# EAGLE design Pi Supply Smart LoRa Gateway (EAGLE 9.5.2)

## Sheet 1 of 5
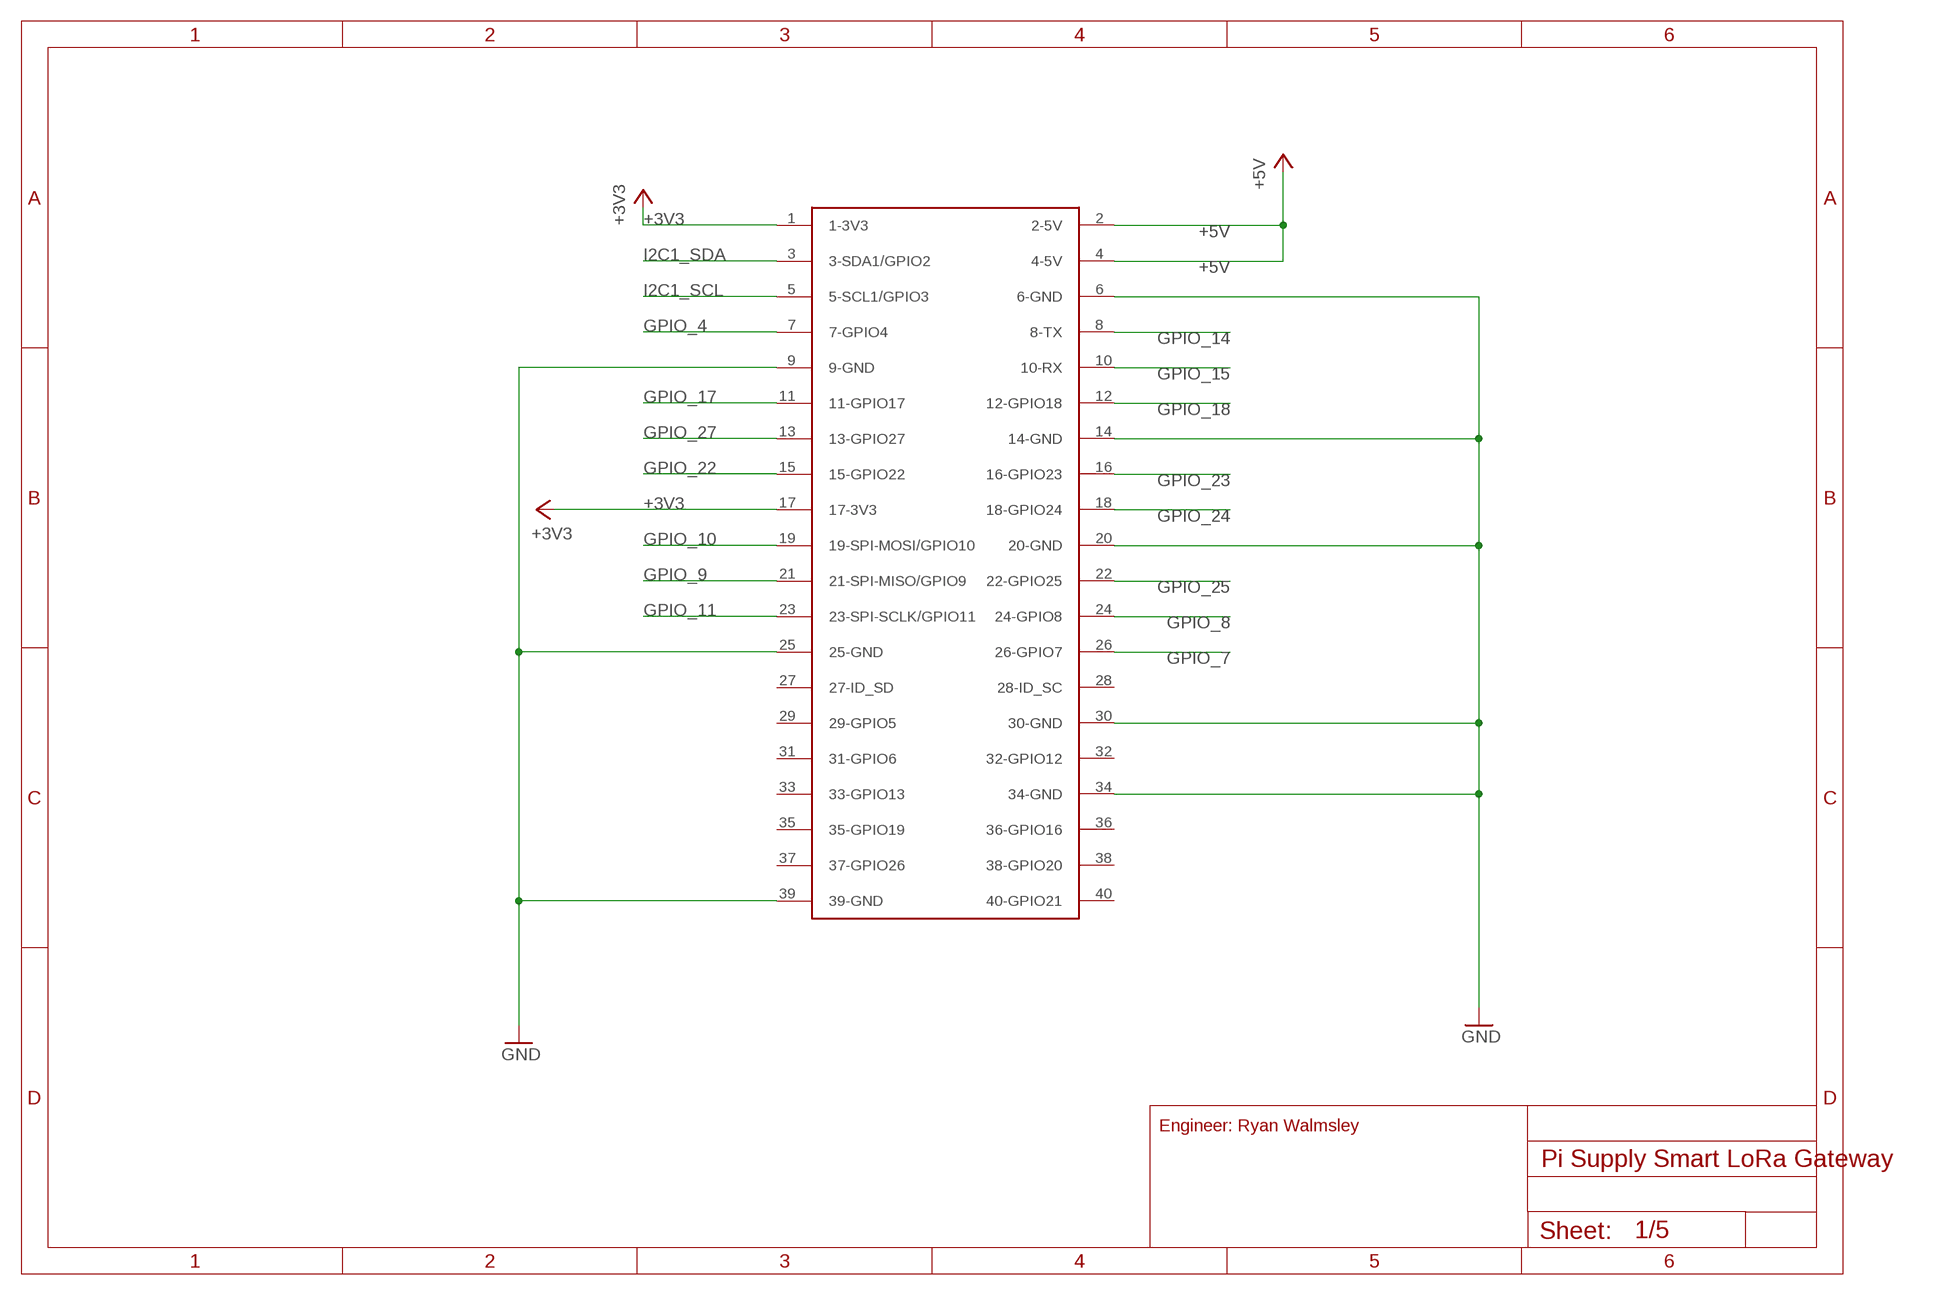
[diagram p0: schematic, sheet 1]

### Parts
U$5  RASPBERRY-PI+NONOTCHES  [RASPBERRY-PI-PLUS]

### Nets
+3V3: U$5.1(1-3V3) U$5.17(17-3V3) ; also sheet 3,4,5
+5V: U$5.2(2-5V) U$5.4(4-5V) ; also sheet 2,4,5
GND: U$5.6(6-GND) U$5.9(9-GND) U$5.14(14-GND) U$5.20(20-GND) U$5.25(25-GND) U$5.30(30-GND) U$5.34(34-GND) U$5.39(39-GND) ; also sheet 2,3,4,5
GPIO_4: U$5.7(7-GPIO4) ; also sheet 2
GPIO_7: U$5.26(26-GPIO7)
GPIO_8: U$5.24(24-GPIO8) ; also sheet 2
GPIO_9: U$5.21(21-SPI-MISO/GPIO9) ; also sheet 2
GPIO_10: U$5.19(19-SPI-MOSI/GPIO10) ; also sheet 2
GPIO_11: U$5.23(23-SPI-SCLK/GPIO11) ; also sheet 2
GPIO_14: U$5.8(8-TX) ; also sheet 2
GPIO_15: U$5.10(10-RX) ; also sheet 2
GPIO_17: U$5.11(11-GPIO17) ; also sheet 2
GPIO_18: U$5.12(12-GPIO18) ; also sheet 2
GPIO_22: U$5.15(15-GPIO22) ; also sheet 2
GPIO_23: U$5.16(16-GPIO23) ; also sheet 2
GPIO_24: U$5.18(18-GPIO24) ; also sheet 2
GPIO_25: U$5.22(22-GPIO25) ; also sheet 2
GPIO_27: U$5.13(13-GPIO27) ; also sheet 2
I2C1_SCL: U$5.5(5-SCL1/GPIO3) ; also sheet 2,3
I2C1_SDA: U$5.3(3-SDA1/GPIO2) ; also sheet 2,3
Unconnected: U$5.27(27-ID_SD) U$5.28(28-ID_SC) U$5.29(29-GPIO5) U$5.31(31-GPIO6) U$5.32(32-GPIO12) U$5.33(33-GPIO13) U$5.35(35-GPIO19) U$5.36(36-GPIO16) U$5.37(37-GPIO26) U$5.38(38-GPIO20) U$5.40(40-GPIO21)

### Notes on the sheet
- Engineer: Ryan Walmsley

## Sheet 2 of 5
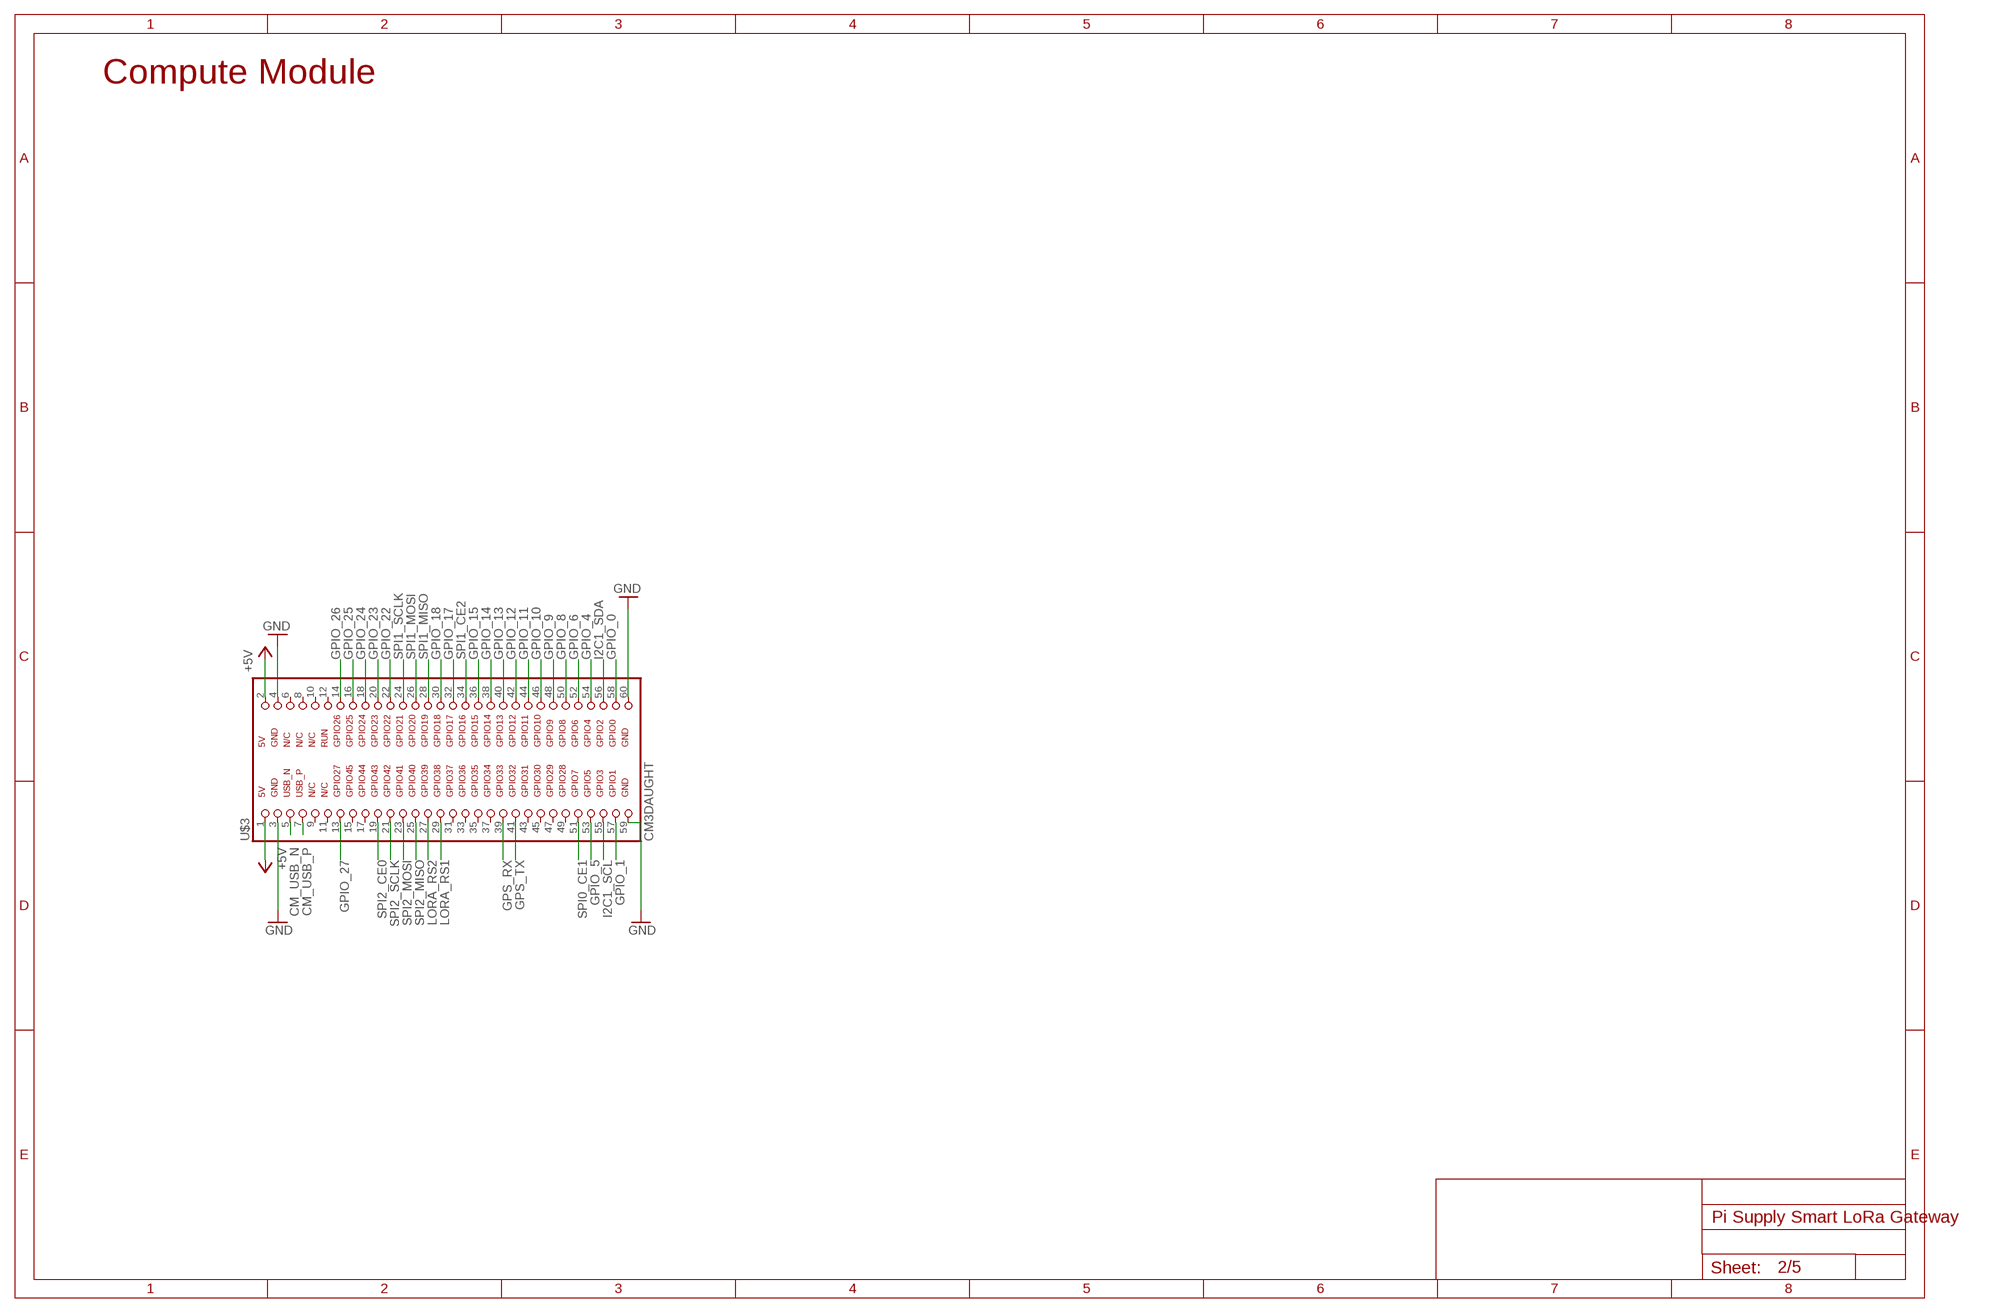
[diagram p1: schematic, sheet 2]

### Parts
U$3  CM3DAUGHT  [2X30]

### Nets
+5V: U$3.1(5V) U$3.2(5V) ; also sheet 1,4,5
CM_USB_N: U$3.5(USB_N) ; also sheet 5
CM_USB_P: U$3.7(USB_P) ; also sheet 5
GND: U$3.3(GND) U$3.4(GND) U$3.59(GND) U$3.60(GND) ; also sheet 1,3,4,5
GPIO_0: U$3.58(GPIO0)
GPIO_1: U$3.57(GPIO1)
GPIO_4: U$3.54(GPIO4) ; also sheet 1
GPIO_5: U$3.53(GPIO5)
GPIO_6: U$3.52(GPIO6)
GPIO_8: U$3.50(GPIO8) ; also sheet 1
GPIO_9: U$3.48(GPIO9) ; also sheet 1
GPIO_10: U$3.46(GPIO10) ; also sheet 1
GPIO_11: U$3.44(GPIO11) ; also sheet 1
GPIO_12: U$3.42(GPIO12)
GPIO_13: U$3.40(GPIO13)
GPIO_14: U$3.38(GPIO14) ; also sheet 1
GPIO_15: U$3.36(GPIO15) ; also sheet 1
GPIO_17: U$3.32(GPIO17) ; also sheet 1
GPIO_18: U$3.30(GPIO18) ; also sheet 1
GPIO_22: U$3.22(GPIO22) ; also sheet 1
GPIO_23: U$3.20(GPIO23) ; also sheet 1
GPIO_24: U$3.18(GPIO24) ; also sheet 1
GPIO_25: U$3.16(GPIO25) ; also sheet 1
GPIO_26: U$3.14(GPIO26)
GPIO_27: U$3.13(GPIO27) ; also sheet 1
GPS_RX: U$3.39(GPIO33) ; also sheet 3
GPS_TX: U$3.41(GPIO32) ; also sheet 3
I2C1_SCL: U$3.55(GPIO3) ; also sheet 1,3
I2C1_SDA: U$3.56(GPIO2) ; also sheet 1,3
LORA_RS1: U$3.29(GPIO38) ; also sheet 3
LORA_RS2: U$3.27(GPIO39) ; also sheet 3
SPI0_CE1: U$3.51(GPIO7)
SPI1_CE2: U$3.34(GPIO16) ; also sheet 3
SPI1_MISO: U$3.28(GPIO19) ; also sheet 3
SPI1_MOSI: U$3.26(GPIO20) ; also sheet 3
SPI1_SCLK: U$3.24(GPIO21) ; also sheet 3
SPI2_CE0: U$3.19(GPIO43) ; also sheet 3
SPI2_MISO: U$3.25(GPIO40) ; also sheet 3
SPI2_MOSI: U$3.23(GPIO41) ; also sheet 3
SPI2_SCLK: U$3.21(GPIO42) ; also sheet 3
Unconnected: U$3.6 U$3.8 U$3.9 U$3.10 U$3.11 U$3.12 U$3.15(GPIO45) U$3.17(GPIO44) U$3.31(GPIO37) U$3.33(GPIO36) U$3.35(GPIO35) U$3.37(GPIO34) U$3.43(GPIO31) U$3.45(GPIO30) U$3.47(GPIO29) U$3.49(GPIO28)

### Notes on the sheet
- Compute Module

## Sheet 3 of 5
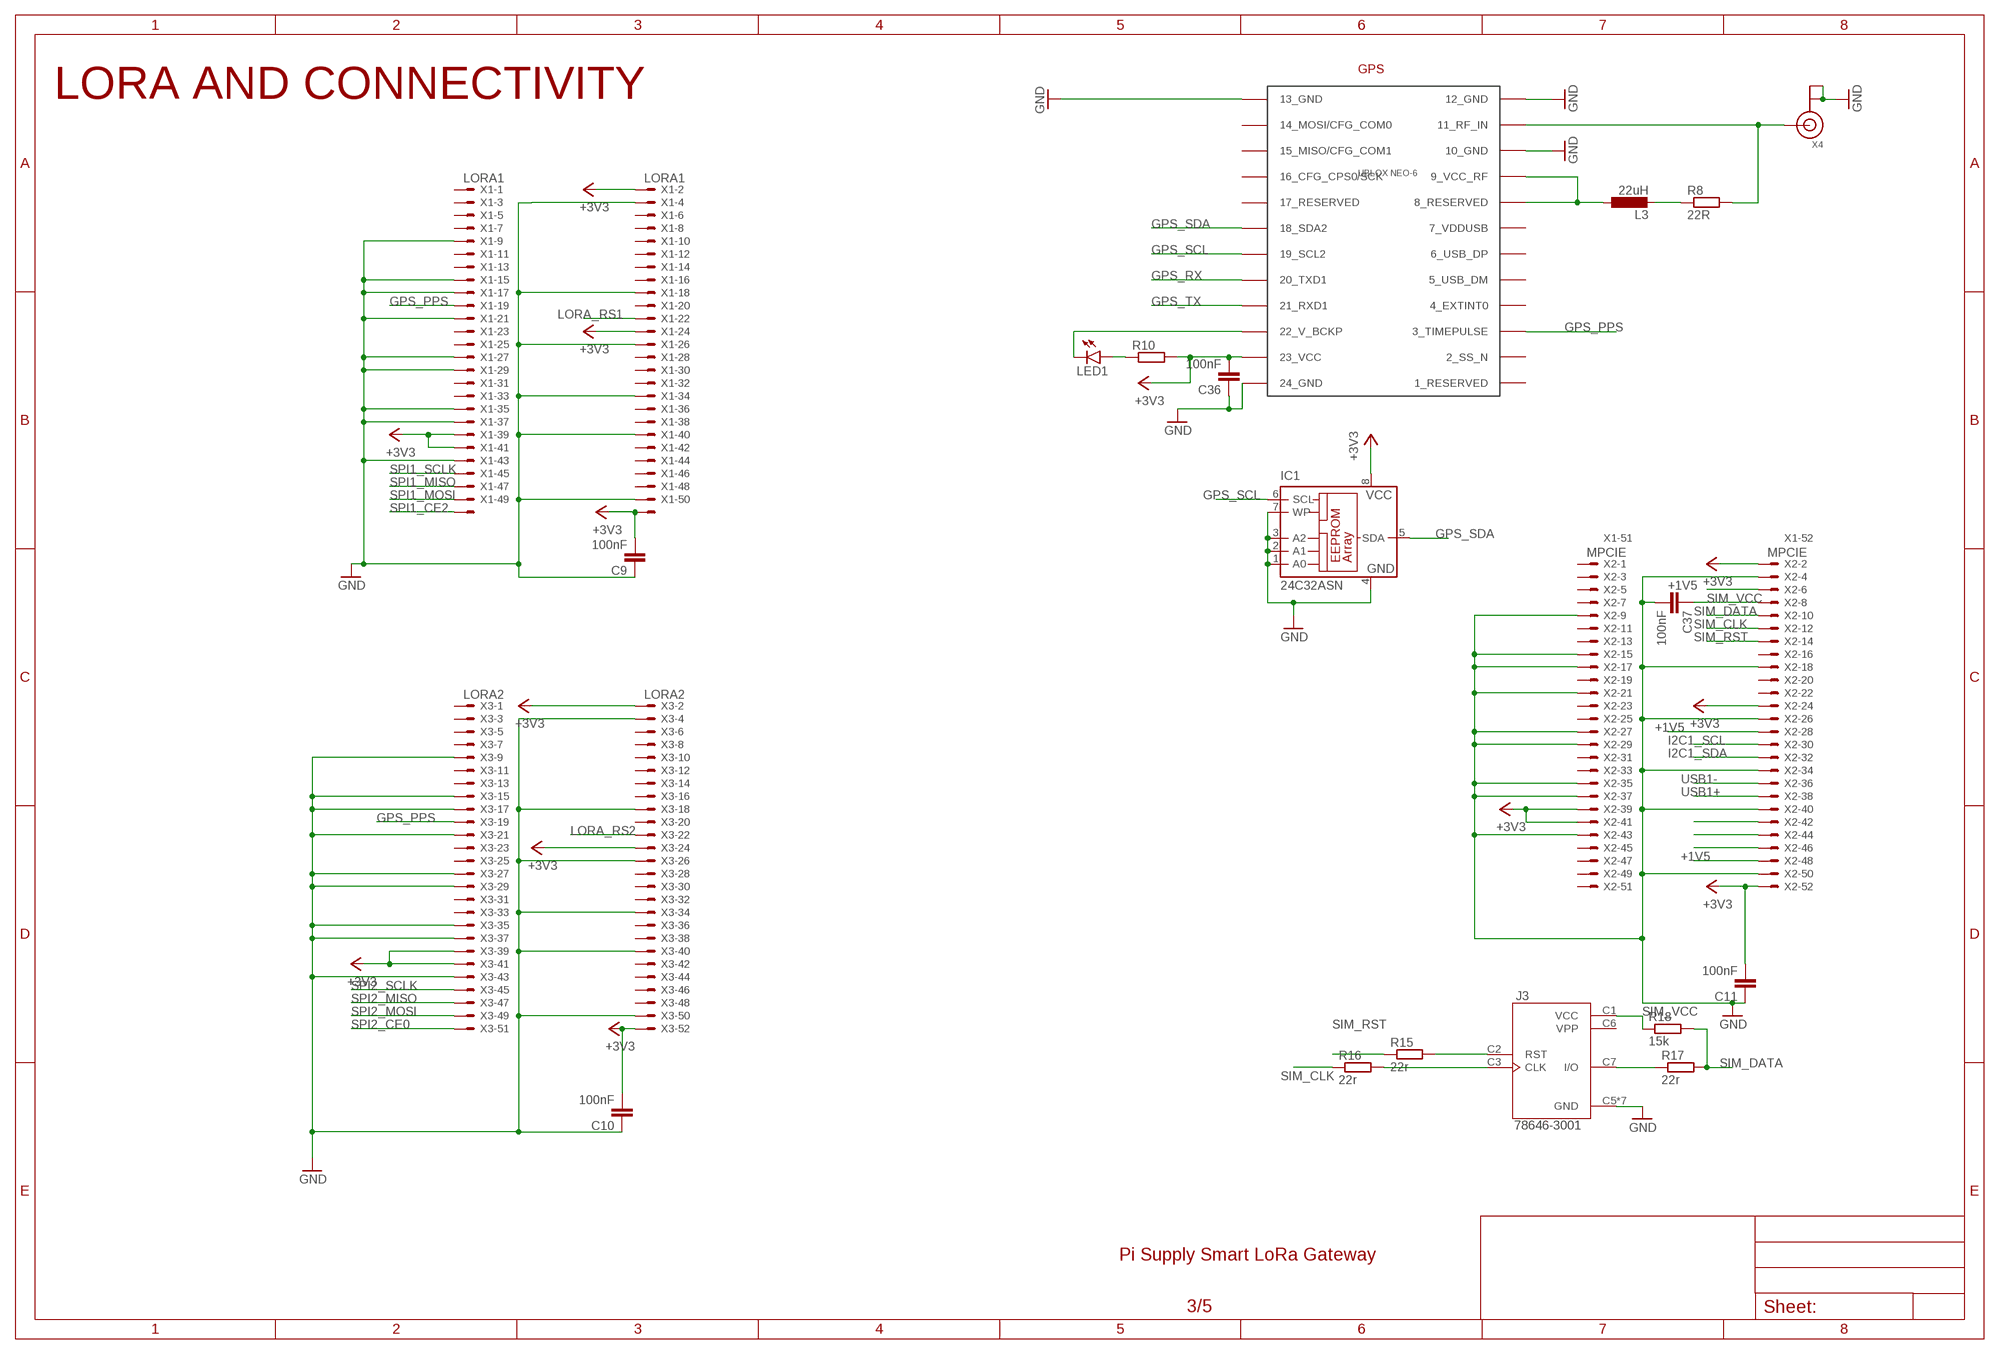
[diagram p2: schematic, sheet 3]

### Parts
C9  100nF  C-EUC0603  [C0603]
C10  100nF  C-EUC0603  [C0603]
C11  100nF  C-EUC0603  [C0603]
C36  100nF  C-EUC0603  [C0603]
C37  100nF  C-EUC0603  [C0603]
IC1  24C32ASN  [SO-08]
J3  78646-3001  [CONN_78646-3001]
L3  22uH  L-EUL2012C  [L2012C]
LED1  LEDCHIPLED_0603  [CHIPLED_0603]
R8  22R  R-EU_R0603  [R0603]
R10  R-EU_R0603  [R0603]
R15  22r  R-EU_R0603  [R0603]
R16  22r  R-EU_R0603  [R0603]
R17  22r  R-EU_R0603  [R0603]
R18  15k  R-EU_R0603  [R0603]
U$4  UBLOX_NEO-6  [UBLOX_NEO-6P]
X1  LORA1  679105700  [679105700]
X2  MPCIE  679105700  [679105700]
X3  LORA2  679105700  [679105700]
X4  ANTENNA_U.FL  [U.FL]

### Nets
+1V5: X2.6 X2.28 X2.48 ; also sheet 4
+3V3: C9.2 C10.2 C11.2 C36.2 IC1.8(VCC) R10.2 U$4.23_VCC X1.2 X1.24 X1.39 X1.41 X1.52 X2.2 X2.24 X2.39 X2.41 X2.52 X3.2 X3.24 X3.39 X3.41 X3.52 ; also sheet 1,4,5
GND: C9.1 C10.1 C11.1 C36.1 C37.2 IC1.1(A0) IC1.2(A1) IC1.3(A2) IC1.4(GND) IC1.7(WP) J3.C5(GND) J3.G1(GND) J3.G2(GND) J3.G3(GND) J3.G4(GND) J3.G5(GND) J3.G6(GND) U$4.10_GND U$4.12_GND U$4.13_GND U$4.24_GND X1.4 X1.9 X1.15 X1.17 X1.18 X1.21 X1.26 X1.27 X1.29 X1.34 X1.35 X1.37 X1.40 X1.43 X1.50 X2.4 X2.9 X2.15 X2.17 X2.18 X2.21 X2.26 X2.27 X2.29 X2.34 X2.35 X2.37 X2.40 X2.43 X2.50 X3.4 X3.9 X3.15 X3.17 X3.18 X3.21 X3.26 X3.27 X3.29 X3.34 X3.35 X3.37 X3.40 X3.43 X3.50 X4.1(GND) X4.2(GND) ; also sheet 1,2,4,5
GPS_PPS: U$4.3_TIMEPULSE X1.19 X3.19
GPS_RX: U$4.20_TXD1 ; also sheet 2
GPS_SCL: IC1.6(SCL) U$4.19_SCL2
GPS_SDA: IC1.5(SDA) U$4.18_SDA2
GPS_TX: U$4.21_RXD1 ; also sheet 2
I2C1_SCL: X2.30 ; also sheet 1,2
I2C1_SDA: X2.32 ; also sheet 1,2
LORA_RS1: X1.22 ; also sheet 2
LORA_RS2: X3.22 ; also sheet 2
N$5: L3.1 U$4.8_RESERVED U$4.9_VCC_RF
N$7: LED1.C U$4.22_V_BCKP
N$8: J3.C7(I/O) R17.1
N$10: J3.C2(RST) R15.2
N$13: J3.C3(CLK) R16.2
N$14: L3.2 R8.1
N$16: R8.2 U$4.11_RF_IN X4.3(SIGNAL)
N$17: LED1.A R10.1
N$29: X2.42
N$30: X2.44
N$31: X2.46
SIM_CLK: R16.1 X2.12
SIM_DATA: R17.2 R18.2 X2.10
SIM_RST: R15.1 X2.14
SIM_VCC: C37.1 J3.C1(VCC) R18.1 X2.8
SPI1_CE2: X1.51 ; also sheet 2
SPI1_MISO: X1.47 ; also sheet 2
SPI1_MOSI: X1.49 ; also sheet 2
SPI1_SCLK: X1.45 ; also sheet 2
SPI2_CE0: X3.51 ; also sheet 2
SPI2_MISO: X3.47 ; also sheet 2
SPI2_MOSI: X3.49 ; also sheet 2
SPI2_SCLK: X3.45 ; also sheet 2
USB1+: X2.38 ; also sheet 5
USB1-: X2.36 ; also sheet 5
Unconnected: U$4.1_RESERVED U$4.2_SS_N U$4.4_EXTINT0 U$4.5_USB_DM U$4.6_USB_DP U$4.7_VDDUSB U$4.14_MOSI/CFG_COM0 U$4.15_MISO/CFG_COM1 U$4.16_CFG_CPS0/SCK U$4.17_RESERVED X1.1 X1.3 X1.5 X1.6 X1.7 X1.8 X1.10 X1.11 X1.12 X1.13 X1.14 X1.16 X1.20 X1.23 X1.25 X1.28 X1.30 X1.31 X1.32 X1.33 X1.36 X1.38 X1.42 X1.44 X1.46 X1.48 X2.1 X2.3 X2.5 X2.7 X2.11 X2.13 X2.16 X2.19 X2.20 X2.22 X2.23 X2.25 X2.31 X2.33 X2.45 X2.47 X2.49 X2.51 X3.1 X3.3 X3.5 X3.6 X3.7 X3.8 X3.10 X3.11 X3.12 X3.13 X3.14 X3.16 X3.20 X3.23 X3.25 X3.28 X3.30 X3.31 X3.32 X3.33 X3.36 X3.38 X3.42 X3.44 X3.46 X3.48

### Notes on the sheet
- GPS
- LORA AND CONNECTIVITY

## Sheet 4 of 5
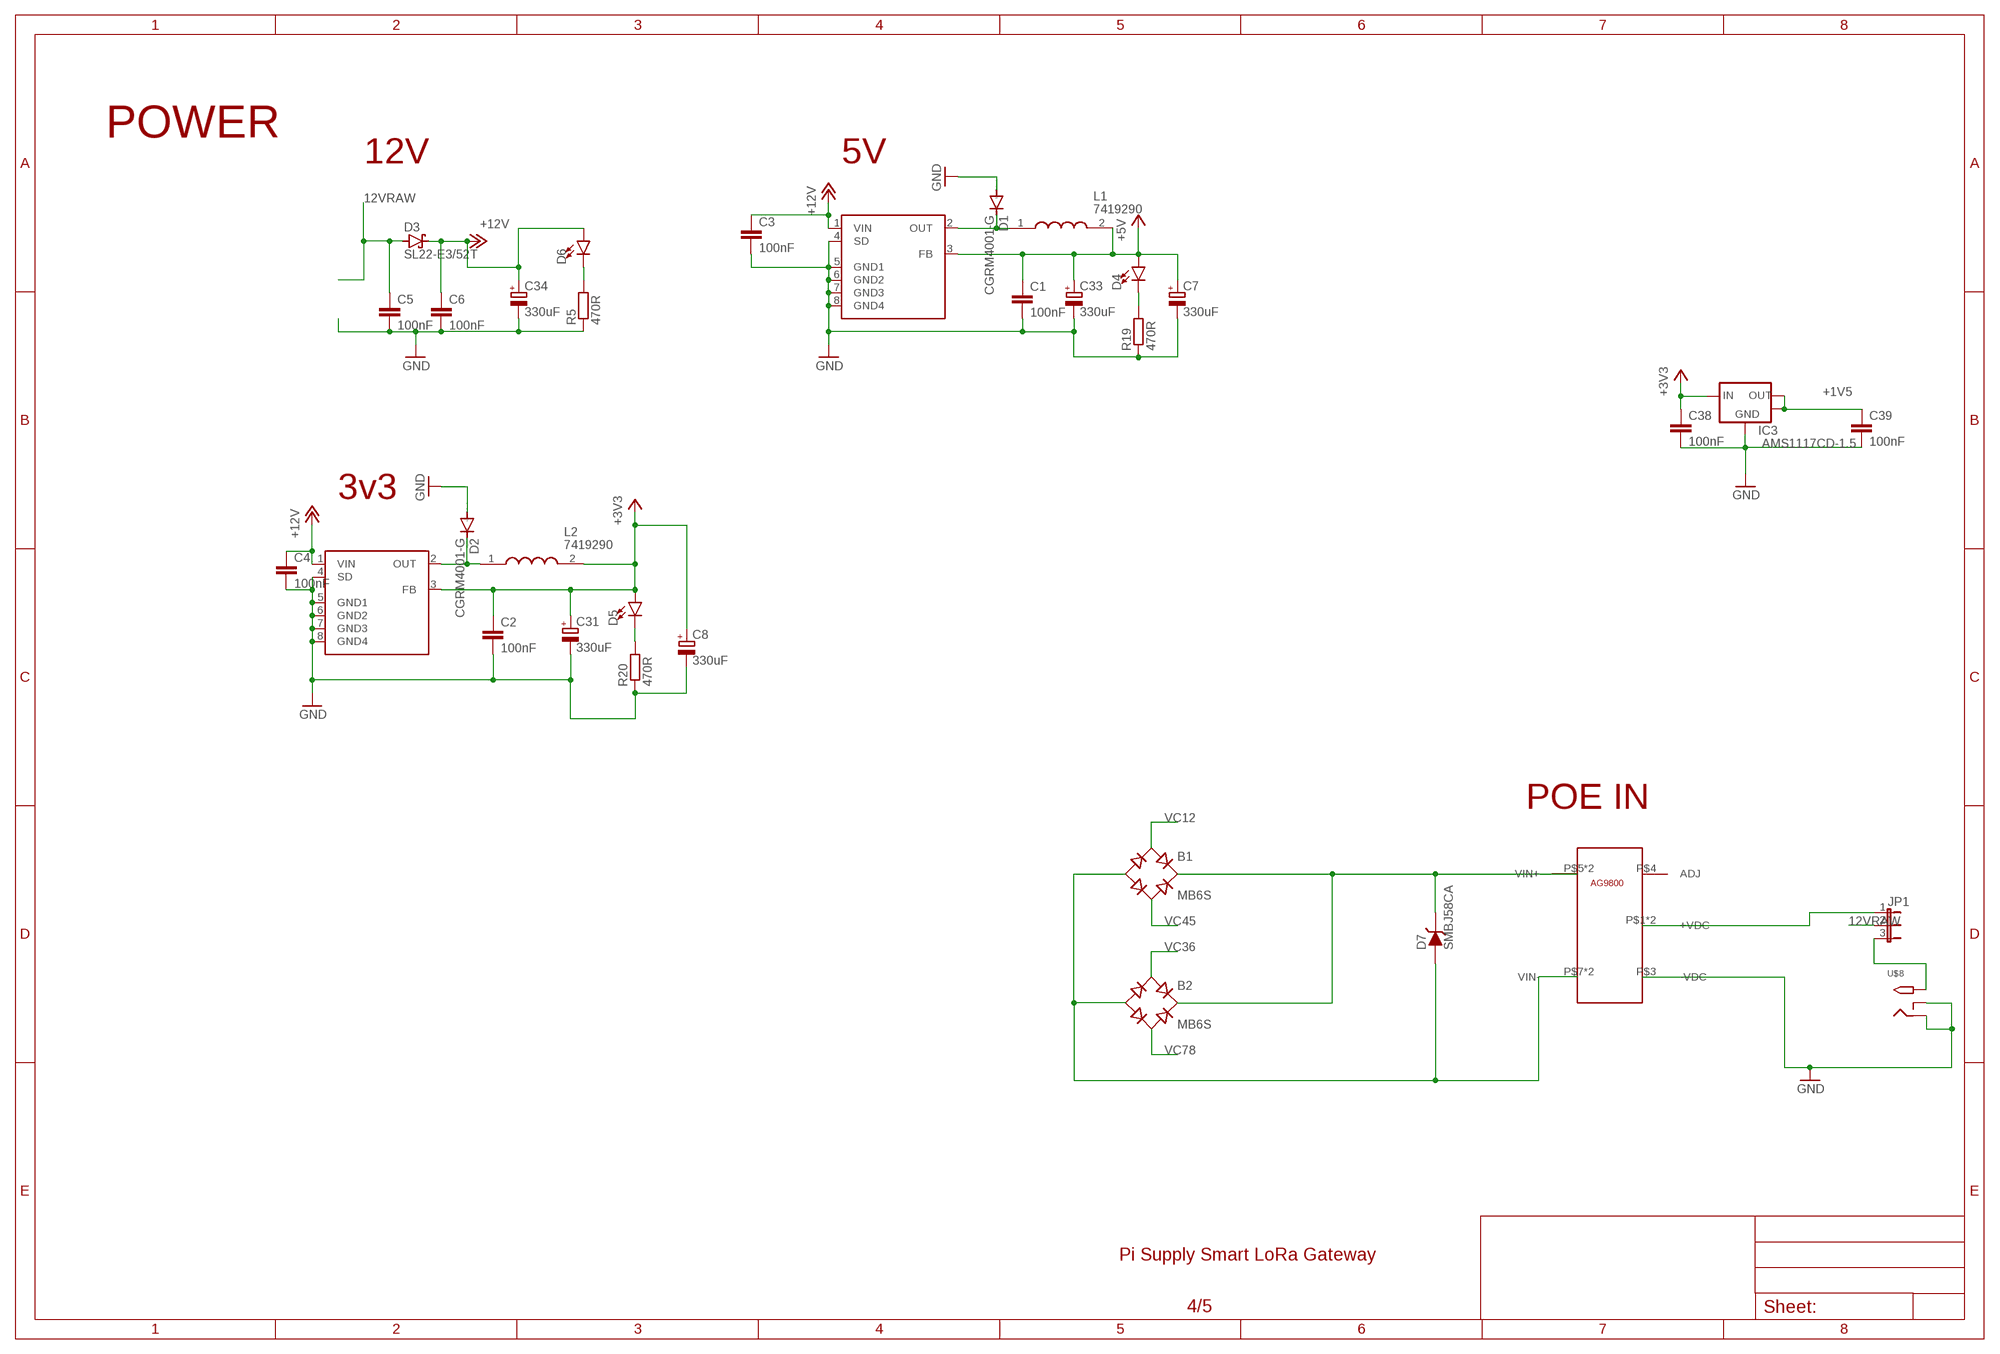
[diagram p3: schematic, sheet 4]

### Parts
B1  MB6S  [SOIC-4]
B2  MB6S  [SOIC-4]
C1  100nF  C-EUC0603  [C0603]
C2  100nF  C-EUC0603  [C0603]
C3  100nF  C-EUC0603  [C0603]
C4  100nF  C-EUC0603  [C0603]
C5  100nF  C-EUC0603  [C0603]
C6  100nF  C-EUC0603  [C0603]
C7  330uF  CPOL-EUE  [PANASONIC_E]
C8  330uF  CPOL-EUE  [PANASONIC_E]
C31  330uF  CPOL-EUE  [PANASONIC_E]
C33  330uF  CPOL-EUE  [PANASONIC_E]
C34  330uF  CPOL-EUE  [PANASONIC_E]
C38  100nF  C-EUC0603  [C0603]
C39  100nF  C-EUC0603  [C0603]
D1  CGRM4001-G  [SOD-123_MINI-SMA]
D2  CGRM4001-G  [SOD-123_MINI-SMA]
D3  SL22-E3/52T  SCHOTTKY-DIODESMD  [SMB]
D4  LED0603  [LED-0603]
D5  LED0603  [LED-0603]
D6  LED0603  [LED-0603]
D7  SMBJ58CA  P6SMBXXAT3GSMA  [DO-214AA]
IC3  AMS1117CD-1.5  LM1117-SOT223  [SOT-223-3]
JP1  JP2E  [JP2]
L1  7419290  [INDPM115100X410N]
L2  7419290  [INDPM115100X410N]
R5  470R  R-EU_R0603  [R0603]
R19  470R  R-EU_R0603  [R0603]
R20  470R  R-EU_R0603  [R0603]
U1  AP1509  [SO08]
U2  AP1509-50  AP1509  [SO08]
U$1  AG9800  [AG9800]
U$8  2.1MMJACKSMT  [DCJACK_2MM_SMT]

### Nets
12VRAW: C5.1 D3.A JP1.2
+1V5: C39.1 IC3.2(VOUT) IC3.4(HEATSINK) ; also sheet 3
+3V3: C2.1 C8.+ C31.+ C38.1 D5.A IC3.3(VIN) L2.2 U1.3(FB) ; also sheet 1,3,5
+5V: C1.1 C7.+ C33.+ D4.A L1.2 U2.3(FB) ; also sheet 1,2,5
+12V: C3.1 C4.1 C6.1 C34.+ D3.C D6.A U1.1(VIN) U2.1(VIN)
GND: C1.2 C2.2 C3.2 C4.2 C5.2 C6.2 C7.- C8.- C31.- C33.- C34.- C38.2 C39.2 D1.A D2.A IC3.1(GND) R5.1 R19.1 R20.1 U1.4(SD) U1.5(GND1) U1.6(GND2) U1.7(GND3) U1.8(GND4) U2.4(SD) U2.5(GND1) U2.6(GND2) U2.7(GND3) U2.8(GND4) U$1.P$3(-VDC) U$8.GND(RING) U$8.GNDBREAK(RING_SW) ; also sheet 1,2,3,5
N$1: JP1.1 U$1.P$1(+VDC) U$1.P$2(+VDC)
N$2: D1.C L1.1 U2.2(OUT)
N$3: JP1.3 U$8.PWR2(TIP)
N$4: D2.C L2.1 U1.2(OUT)
N$6: D6.C R5.2
N$9: D4.C R19.2
N$23: D5.C R20.2
POEVIN+: B1.+ B2.+ D7.P$1(C) U$1.P$5(VIN+) U$1.P$6(VIN+)
POEVIN-: B1.- B2.- D7.P$2(A) U$1.P$7(VIN-) U$1.P$8(VIN-)
VC12: B1.~1(AC1) ; also sheet 5
VC36: B2.~1(AC1) ; also sheet 5
VC45: B1.~2(AC2) ; also sheet 5
VC78: B2.~2(AC2) ; also sheet 5
Unconnected: U$1.P$4(ADJ)

### Notes on the sheet
- POWER
- 12V
- 5V
- 3v3
- POE IN

## Sheet 5 of 5
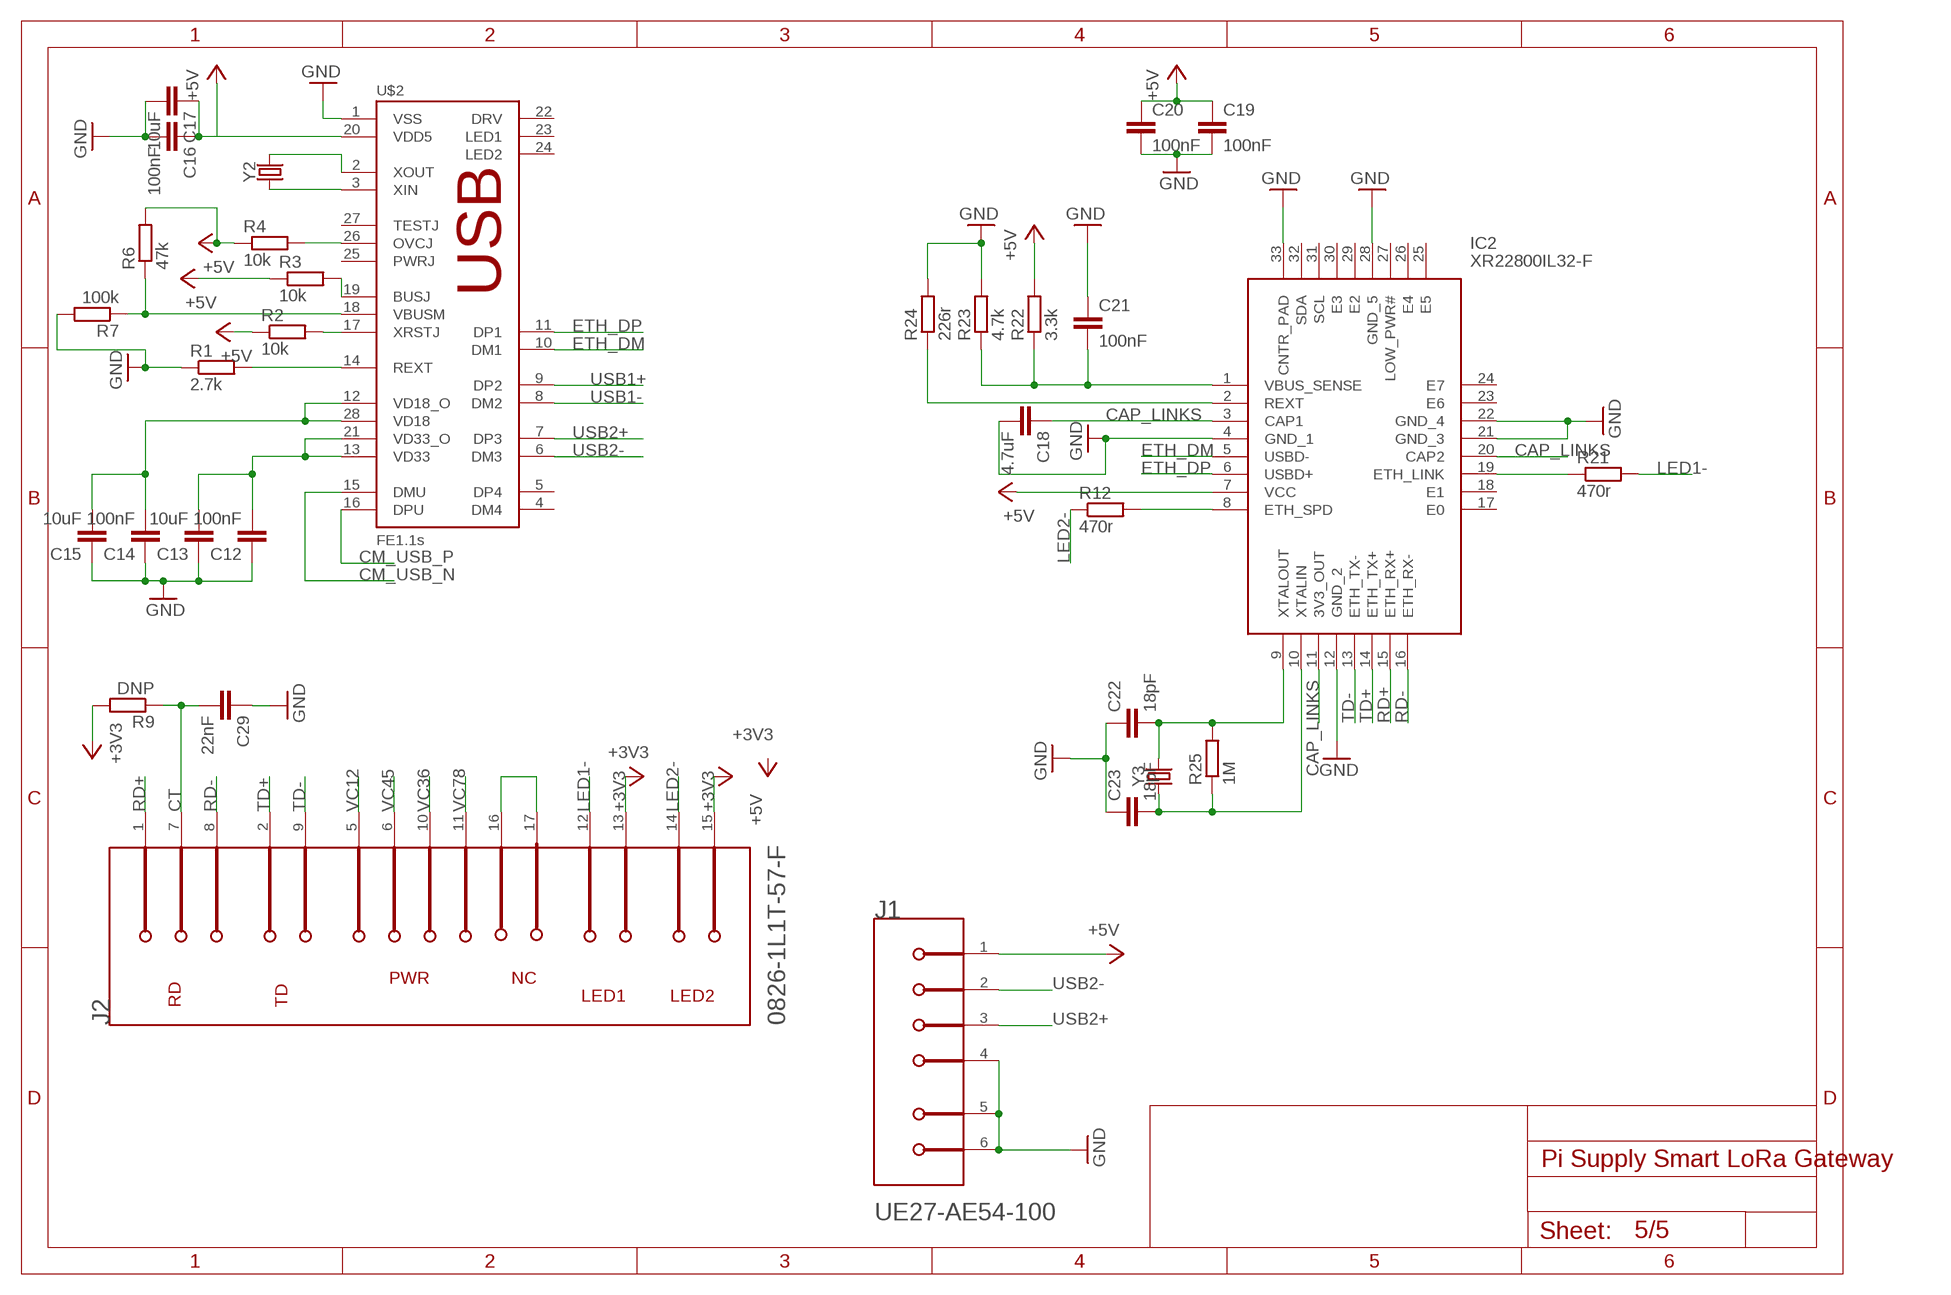
[diagram p4: schematic, sheet 5]

### Parts
C12  100nF  C-EUC0603  [C0603]
C13  10uF  C-EUC0603  [C0603]
C14  100nF  C-EUC0603  [C0603]
C15  10uF  C-EUC0603  [C0603]
C16  100nF  C-EUC0603  [C0603]
C17  10uF  C-EUC0603  [C0603]
C18  4.7uF  C-EUC0603  [C0603]
C19  100nF  C-EUC0603  [C0603]
C20  100nF  C-EUC0603  [C0603]
C21  100nF  C-EUC0603  [C0603]
C22  18pF  C-EUC0603  [C0603]
C23  18pF  C-EUC0603  [C0603]
C29  22nF  C-EUC0603  [C0603]
IC2  XR22800IL32-F  [QFN50P500X500X100-33N]
J1  AMPHENOL_UE27-AE54-100AMPHENOL_UE27-AE54-100_0_0  [AMPHENOL_UE27-AE54-100_0]
J2  TRJK1014A8NL  BEL_0826-1L1T-57-FBEL_0826-1L1T-57-F_0_0  [BEL_0826-1L1T-57-F_0]
R1  2.7k  R-EU_R0603  [R0603]
R2  10k  R-EU_R0603  [R0603]
R3  10k  R-EU_R0603  [R0603]
R4  10k  R-EU_R0603  [R0603]
R6  47k  R-EU_R0603  [R0603]
R7  100k  R-EU_R0603  [R0603]
R9  DNP  R-EU_R0603  [R0603]
R12  470r  R-EU_R0603  [R0603]
R21  470r  R-EU_R0603  [R0603]
R22  3.3k  R-EU_R0603  [R0603]
R23  4.7k  R-EU_R0603  [R0603]
R24  226r  R-EU_R0603  [R0603]
R25  1M  R-EU_R0603  [R0603]
U$2  FE1.1S  [FE1.1S_SSOP-28]
Y2  12mHZ  CRYSTALSMD-HC49UP  [HC49UP]
Y3  25Mhz  CRYSTALSMD-HC49UP  [HC49UP]

### Nets
+3V3: J2.13(2_LED1) J2.15(LED2_ANODE) R9.2 ; also sheet 1,3,4
+5V: C16.1 C17.1 C19.1 C20.1 IC2.7(VCC) J1.1 R2.1 R3.1 R4.1 R6.2 R22.2 U$2.20(VDD5) ; also sheet 1,2,4
CAP_LINKS: C18.1 IC2.3(CAP1) IC2.11(3V3_OUT) IC2.20(CAP2)
CM_USB_N: U$2.15(DMU) ; also sheet 2
CM_USB_P: U$2.16(DPU) ; also sheet 2
CT: C29.2 J2.7(CT) R9.1
ETH_DM: IC2.5(USBD-) U$2.10(DM1)
ETH_DP: IC2.6(USBD+) U$2.11(DP1)
GND: C12.1 C13.1 C14.1 C15.1 C16.2 C17.2 C18.2 C19.2 C20.2 C21.1 C22.1 C23.1 C29.1 IC2.4(GND_1) IC2.12(GND_2) IC2.21(GND_3) IC2.22(GND_4) IC2.28(GND_5) IC2.33(CNTR_PAD) J1.4 J1.5(MNT_1) J1.6(MNT_2) R1.1 R7.2 R23.2 R24.2 U$2.1(VSS) ; also sheet 1,2,3,4
LED1-: J2.12(1_LED1) R21.2
LED2-: J2.14(LED2_CATHODE) R12.1
N$11: C12.2 C13.2 U$2.13(VD33) U$2.21(VD33_O)
N$12: C14.2 C15.2 U$2.12(VD18_O) U$2.28(VD18)
N$19: R4.2 U$2.26(OVCJ)
N$20: R1.2 U$2.14(REXT)
N$21: R3.2 U$2.19(BUSJ)
N$22: R6.1 R7.1 U$2.18(VBUSM)
N$24: R2.2 U$2.17(XRSTJ)
N$25: U$2.2(XOUT) Y2.2
N$26: U$2.3(XIN) Y2.1
N$27: IC2.19(ETH_LINK) R21.1
N$37: C23.2 IC2.10(XTALIN) R25.1 Y3.1
N$39: C22.2 IC2.9(XTALOUT) R25.2 Y3.2
N$40: IC2.8(ETH_SPD) R12.2
N$45: J2.16(1_GND) J2.17(2_GND)
N$47: IC2.2(REXT) R24.1
N$48: C21.2 IC2.1(VBUS_SENSE) R22.1 R23.1
RD+: IC2.15(ETH_RX+) J2.1(RD+)
RD-: IC2.16(ETH_RX-) J2.8(RD-)
TD+: IC2.14(ETH_TX+) J2.2(TD+)
TD-: IC2.13(ETH_TX-) J2.9(TD-)
USB1+: U$2.9(DP2) ; also sheet 3
USB1-: U$2.8(DM2) ; also sheet 3
USB2+: J1.3 U$2.7(DP3)
USB2-: J1.2 U$2.6(DM3)
VC12: J2.5(VC12) ; also sheet 4
VC36: J2.10(VC36) ; also sheet 4
VC45: J2.6(VC45) ; also sheet 4
VC78: J2.11(VC78) ; also sheet 4
Unconnected: IC2.17(E0) IC2.18(E1) IC2.23(E6) IC2.24(E7) IC2.25(E5) IC2.26(E4) IC2.27(LOW_PWR#) IC2.29(E2) IC2.30(E3) IC2.31(SCL) IC2.32(SDA) U$2.4(DM4) U$2.5(DP4) U$2.22(DRV) U$2.23(LED1) U$2.24(LED2) U$2.25(PWRJ) U$2.27(TESTJ)

### Notes on the sheet
- USB
- PWR | NC
- LED1 | LED2
- RD | TD

## Power pins joined to a net without a drawn wire
VPP: J3.C6(VPP)

## Library data of the parts
B1 B2 = rectifier:MB*S: Bridge Rectifier Source: http://www.fairchildsemi.com/ds/MB/MB6S.pdf
C1-C6 C9-C23 C29 C36-C39 = resistor:C-EU: CAPACITOR, European symbol
C7 C8 C31 C33 C34 = resistor:CPOL-EU: POLARIZED CAPACITOR, European symbol
D1 D2 = diode:CGRM400*-G: Molded plasitc,JEDEC SOD-123/Mini SMA Source: Comchip CGRM4001-G.pdf
D3 = diode:SCHOTTKY-DIODE: Schottky Diode
D4-D6 = SparkFun-LED:LED: LED (Generic) Standard schematic elements and footprints for 5mm, 3mm, 1206, and 0603 sized LEDs. Generic LEDs with no color specified.
D7 = bt_diode:P6SMBXXAT3G: SMBxxAT3G TVS Diode The SMB series is designed to protect voltage sensitive components from high voltage, high energy transients. They have excellent clamping capability, high surge capability, low zener impedance and fast response time. The SMB series is supplied in ON Semiconductor’s exclusive, cost-effective, highly reliable SURMETIC® package and is ideally suited for use in communication systems, automotive, numerical controls, process controls, medical equipment, business machines, power supplies and many other industrial/consumer applications. http://www.onsemi.com/pub_link/Collateral/P6SMB6.8AT3-D.PDF <datasheet.pdf>
IC1 = microchip:24*: Serial EEPROM I2C; MPN: IS24C32A-2GLI; OC_FARNELL: 1224413; OC_NEWARK: 43M4588
IC2 = XR22800IL32-F:XR22800IL32-F: USB Interface IC Hi-Speed USB 10/100 Ethernet Bridge Source: Datasheet <https://www.maxlinear.com/ds/xr22800.pdf>; DESCRIPTION: USB Interface IC Hi-Speed USB 10/100 Ethernet Bridge; HEIGHT: 1mm; MANUFACTURER_NAME: MaxLinear; MANUFACTURER_PART_NUMBER: XR22800IL32-F; MOUSER_PART_NUMBER: 701-22800IL32-F; MOUSER_PRICE-STOCK: https://www.mouser.com/Search/Refine.aspx?Keyword=701-22800IL32-F
IC3 = bt_regulator:LM1117: LDO Voltage Regulator NCP1117 series are low dropout positive voltage regulators that are capable of providing an output current that is in excess of 1.0 A with a maximum dropout voltage of 1.2 V at 800 mA over temperature. This series contains nine fixed output voltages of 1.5 V, 1.8 V, 1.9 V, 2.0 V, 2.5 V, 2.85 V, 3.3 V, 5.0 V, and 12 V that have no minimum load requirement to maintain regulation. Also included is an adjustable output version that can be programmed from 1.25 V to 18.8 V with two external resistors. datasheet.pdf <http://www.onsemi.com/pub_link/Collateral/NCP1117-D.PDF> LM1117-N is a series of low dropout voltage regulators of 1.2V at 800mA of load current. It has the same pin-out as Texas Instruments' industry standard LM317. The LM1117-N is available in an adjustable version, available in five fixed voltages, 1.8V, 2.5V, 2.85V, 3.3V, and 5V. The LM1117-N offers current limiting and thermal shutdown. Its circuit includes a zener trimmed to within ±1%. datasheet.pdf <http://www.ti.com/lit/ds/symlink/lm1117-n.pdf>
J1 = Amphenol - UE27-AE54-100:AMPHENOL_UE27-AE54-100: CONN RCPT USB TYPE A VERT GOLD; CENTROID_NOT_SPECIFIED: No; CONN_ORIENTATION: Vertical; CONTACT_MATERIAL: Gold,Nickel; CURRENT_RATING: 1.5A; DATASHEET: https://signin.amphenolcanada.com/ProductSearch/drawings/AC/UE27AEX4X0X.pdf; DEVICE_CLASS_L1: Connectors; DEVICE_CLASS_L2: USB Connectors; DEVICE_CLASS_L3: unset; DIGIKEY_DESCRIPTION: CONN RCPT USB TYPE A VERT GOLD; DIGIKEY_PART_NUMBER: UE27AE54100-ND; HEIGHT: 14mm; IS_FEMALE: yes; LEAD_FREE: yes; MF: Amphenol; MFG_PACKAGE_IDENT: UE27-AE54-100; MFG_PACKAGE_IDENT_DATE: 0; MFG_PACKAGE_IDENT_REV: 0; MOUSER_DESCRIPTION: CONN RCPT USB TYPE A VERT GOLD; MOUSER_PART_NUMBER: 523-UE27-AE54-100; MPN: UE27-AE54-100; NUMBER_OF_CONTACTS: 4; PACKAGE: PTH_USB_CONN_VERT; PREFIX: J; ROHS: yes; SHIELDING: true; TEMPERATURE_RANGE_HIGH: +85°C; TEMPERATURE_RANGE_LOW: -40°C; USB_STANDARD: USB 2.0; VERIFICATION_VERSION: 0.0.0.1; VOLTAGE_RATING: 250V
J2 = Bel - 0826-1L1T-57-F:BEL_0826-1L1T-57-F: CONN MAGJACK 1PORT 100 BASE-T; CENTROID_NOT_SPECIFIED: No; CONN_GENDER: Female; CONN_ORIENTATION: Right Angle; CONTACT_MATERIAL: Tin; DATASHEET: https://belfuse.com/resources/drawings/magneticsolutions/dr-mag-0826-1l1t-57-f.pdf; DEVICE_CLASS_L1: Connectors; DEVICE_CLASS_L2: Modular / Ethernet Connectors; DEVICE_CLASS_L3: unset; DIGIKEY_DESCRIPTION: CONN MAGJACK 1PORT 100 BASE-T; DIGIKEY_PART_NUMBER: 507-1431-ND; HEIGHT: 15.774mm; IS_FEMALE: yes; LEAD_FREE: yes; MF: Bel; MFG_PACKAGE_IDENT: 0826-1L1T-57-F; MFG_PACKAGE_IDENT_DATE: 0; MFG_PACKAGE_IDENT_REV: 0; MOUSER_DESCRIPTION: Conn RJ-45 RCP 8 POS Solder RA Thru-Hole 12 Terminal 1 Port Tray; MOUSER_PART_NUMBER: 530-0826-1L1T-57-F; MPN: 0826-1L1T-57-F; NUMBER_OF_CONTACTS: 9; PACKAGE: CONN_MAGJACK; PREFIX: J; ROHS: yes; SHIELDING: true; TEMPERATURE_RANGE_HIGH: +70°C; TEMPERATURE_RANGE_LOW: 0°C; VERIFICATION_VERSION: 0.0.0.1
J3 = 78646-3001:78646-3001: Conn Micro SIM Card SKT 6 POS 2.54mm Solder RA SMD 0.5A/Contact Embossed T/R; AVAILABILITY: Unavailable; DESCRIPTION: Conn Micro SIM Card SKT 6 POS 2.54mm Solder RA SMD 0.5A/Contact Embossed T/R; MF: Molex, LLC; MP: 78646-3001; PACKAGE: None; PRICE: None
JP1 = jumper:JP2E: JUMPER
L1 L2 = SamacSys_Parts:7419290: RS Pro NPIS104F Series Shielded Wire-wound SMD Inductor 47 H 20% 1.9A Idc Source: Datasheet <http://docs-europe.electrocomponents.com/webdocs/1581/0900766b81581d01.pdf>; DESCRIPTION: RS Pro NPIS104F Series Shielded Wire-wound SMD Inductor 47 H 20% 1.9A Idc; HEIGHT: 4.1mm; MANUFACTURER_NAME: RS Components; MANUFACTURER_PART_NUMBER: 7419290; RS_PART_NUMBER: 7419290
L3 = resistor:L-EU: INDUCTOR, European symbol
LED1 = led:LED: LED OSRAM: - CHIPLED LG R971, LG N971, LY N971, LG Q971, LY Q971, LO R971, LY R971 LH N974, LH R974 LS Q976, LO Q976, LY Q976 LO Q996 - Hyper CHIPLED LW Q18S LB Q993, LB Q99A, LB R99A - SideLED LS A670, LO A670, LY A670, LG A670, LP A670 LB A673, LV A673, LT A673, LW A673 LH A674 LY A675 LS A676, LA A676, LO A676, LY A676, LW A676 LS A679, LY A679, LG A679 - Hyper Micro SIDELED® LS Y876, LA Y876, LO Y876, LY Y876 LT Y87S - SmartLED LW L88C, LW L88S LB L89C, LB L89S, LG L890 LS L89K, LO L89K, LY L89K LS L896, LA L896, LO L896, LY L896 - TOPLED LS T670, LO T670, LY T670, LG T670, LP T670 LSG T670, LSP T670, LSY T670, LOP T670, LYG T670 LG T671, LOG T671, LSG T671 LB T673, LV T673, LT T673, LW T673 LH T674 LS T676, LA T676, LO T676, LY T676, LB T676, LH T676, LSB T676, LW T676 LB T67C, LV T67C, LT T67C, LS T67K, LO T67K, LY T67K, LW E67C LS E67B, LA E67B, LO E67B, LY E67B, LB E67C, LV E67C, LT E67C LW T67C LS T679, LY T679, LG T679 LS T770, LO T770, LY T770, LG T770, LP T770 LB T773, LV T773, LT T773, LW T773 LH T774 LS E675, LA E675, LY E675, LS T675 LS T776, LA T776, LO T776, LY T776, LB T776 LHGB T686 LT T68C, LB T68C - Hyper Mini TOPLED® LB M676 - Mini TOPLED Santana® LG M470 LS M47K, LO M47K, LY M47K Source: http://www.osram.convergy.de LUXEON: - LUMILED® LXK2-PW12-R00, LXK2-PW12-S00, LXK2-PW14-U00, LXK2-PW14-V00 LXK2-PM12-R00, LXK2-PM12-S00, LXK2-PM14-U00 LXK2-PE12-Q00, LXK2-PE12-R00, LXK2-PE12-S00, LXK2-PE14-T00, LXK2-PE14-U00 LXK2-PB12-K00, LXK2-PB12-L00, LXK2-PB12-M00, LXK2-PB14-N00, LXK2-PB14-P00, LXK2-PB14-Q00 LXK2-PR12-L00, LXK2-PR12-M00, LXK2-PR14-Q00, LXK2-PR14-R00 LXK2-PD12-Q00, LXK2-PD12-R00, LXK2-PD12-S00 LXK2-PH12-R00, LXK2-PH12-S00 LXK2-PL12-P00, LXK2-PL12-Q00, LXK2-PL12-R00 Source: www.luxeon.com KINGBRIGHT: KA-3528ASYC Source: www.kingbright.com
R1-R10 R12 R15-R25 = resistor:R-EU_: RESISTOR, European symbol
U1 U2 = bt_regulator:AP1509: AP1509, 150KHz, 2A PWM BUCK DC/DC CONVERTER The AP1509 series are monolithic IC designed for a stepdown DC/DC converter, and own the ability of driving a 2A load without additional transistor. Datasheet.pdf <http://www.diodes.com/_files/datasheets/AP1509.pdf>
U$1 = ryanteck:AG9800
U$2 = Ai_IC:FE1.1S
U$3 = ryanteck:CM3DAUGHT
U$4 = Ava:UBLOX_NEO-6: UBLOX NEO-6 GPS MODULE Author Anthony Stirk / http://ava.upuaut.net http://www.u-blox.com/images/downloads/Product_Docs/LEA-6_NEO-6_MAX_HardwareIntegrationManual_%28GPS.G6-HW-09007%29.pdf http://www.u-blox.com/images/downloads/Product_Docs/NEO-6_DataSheet_%28GPS.G6-HW-09005%29.pdf
U$5 = Ava2:RASPBERRY-PI+: Samtec SSW-120-01-T-D
U$8 = adafruit:2.1MMJACK: 2.1mm x 5.5mm THM DC jack with internal switch. Digikey part #PJ-102A, 4UCON part #05537 2.1mm x 5.5mm SMT DC jack with internal switch. Digikey part #PJ-002A-SMT, 4UCON part #03267 By microbuilder.eu & adafruit.com
X1-X3 = con-molex:679105700: MINI PCI EXPRESS CONNECTOR 0.8MM PITCH, 52 CIRCUIT Source: http://www.molex.com/pdm_docs/sd/679105700_sd.pdf; MPN: 67910-5700; OC_FARNELL: unknown; OC_NEWARK: 93M2128
X4 = adafruit:ANTENNA_U.FL: U.FL Antenna Connector
Y2 Y3 = SparkFun-Clocks:CRYSTAL: Crystals (Generic) These are passive quartz crystals, which can be used as a clock source for a microcontroller. Crystal's are two-terminal devices. They require external "load" capacitors to generate an oscillating signal.

## Board
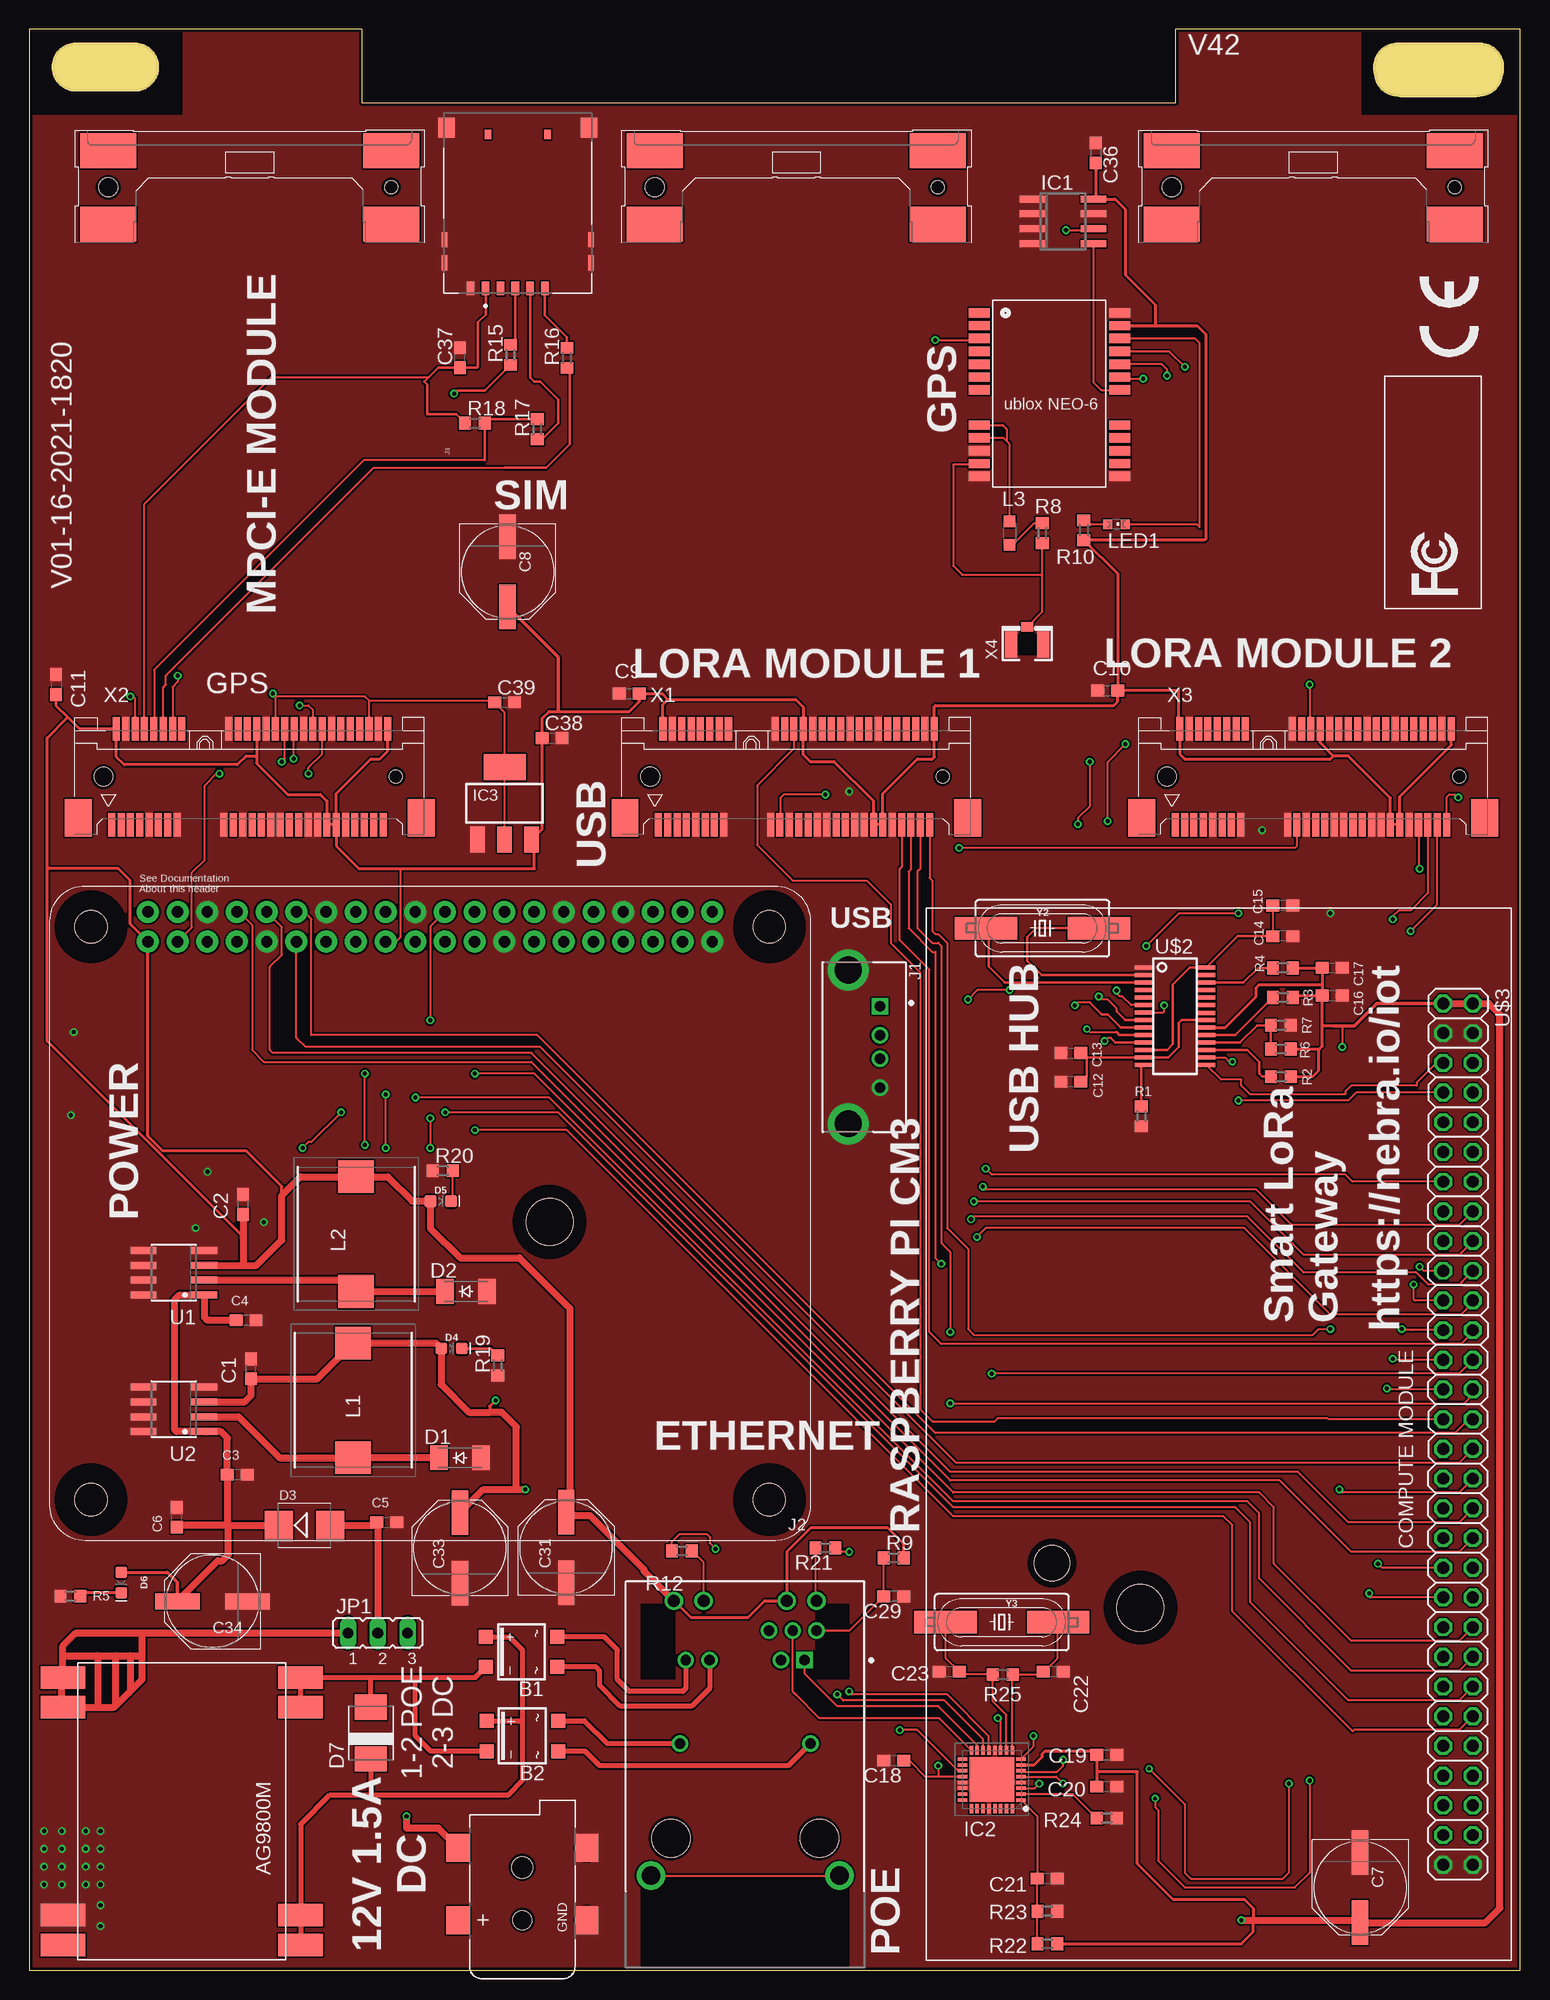
[diagram p5: board, top side]
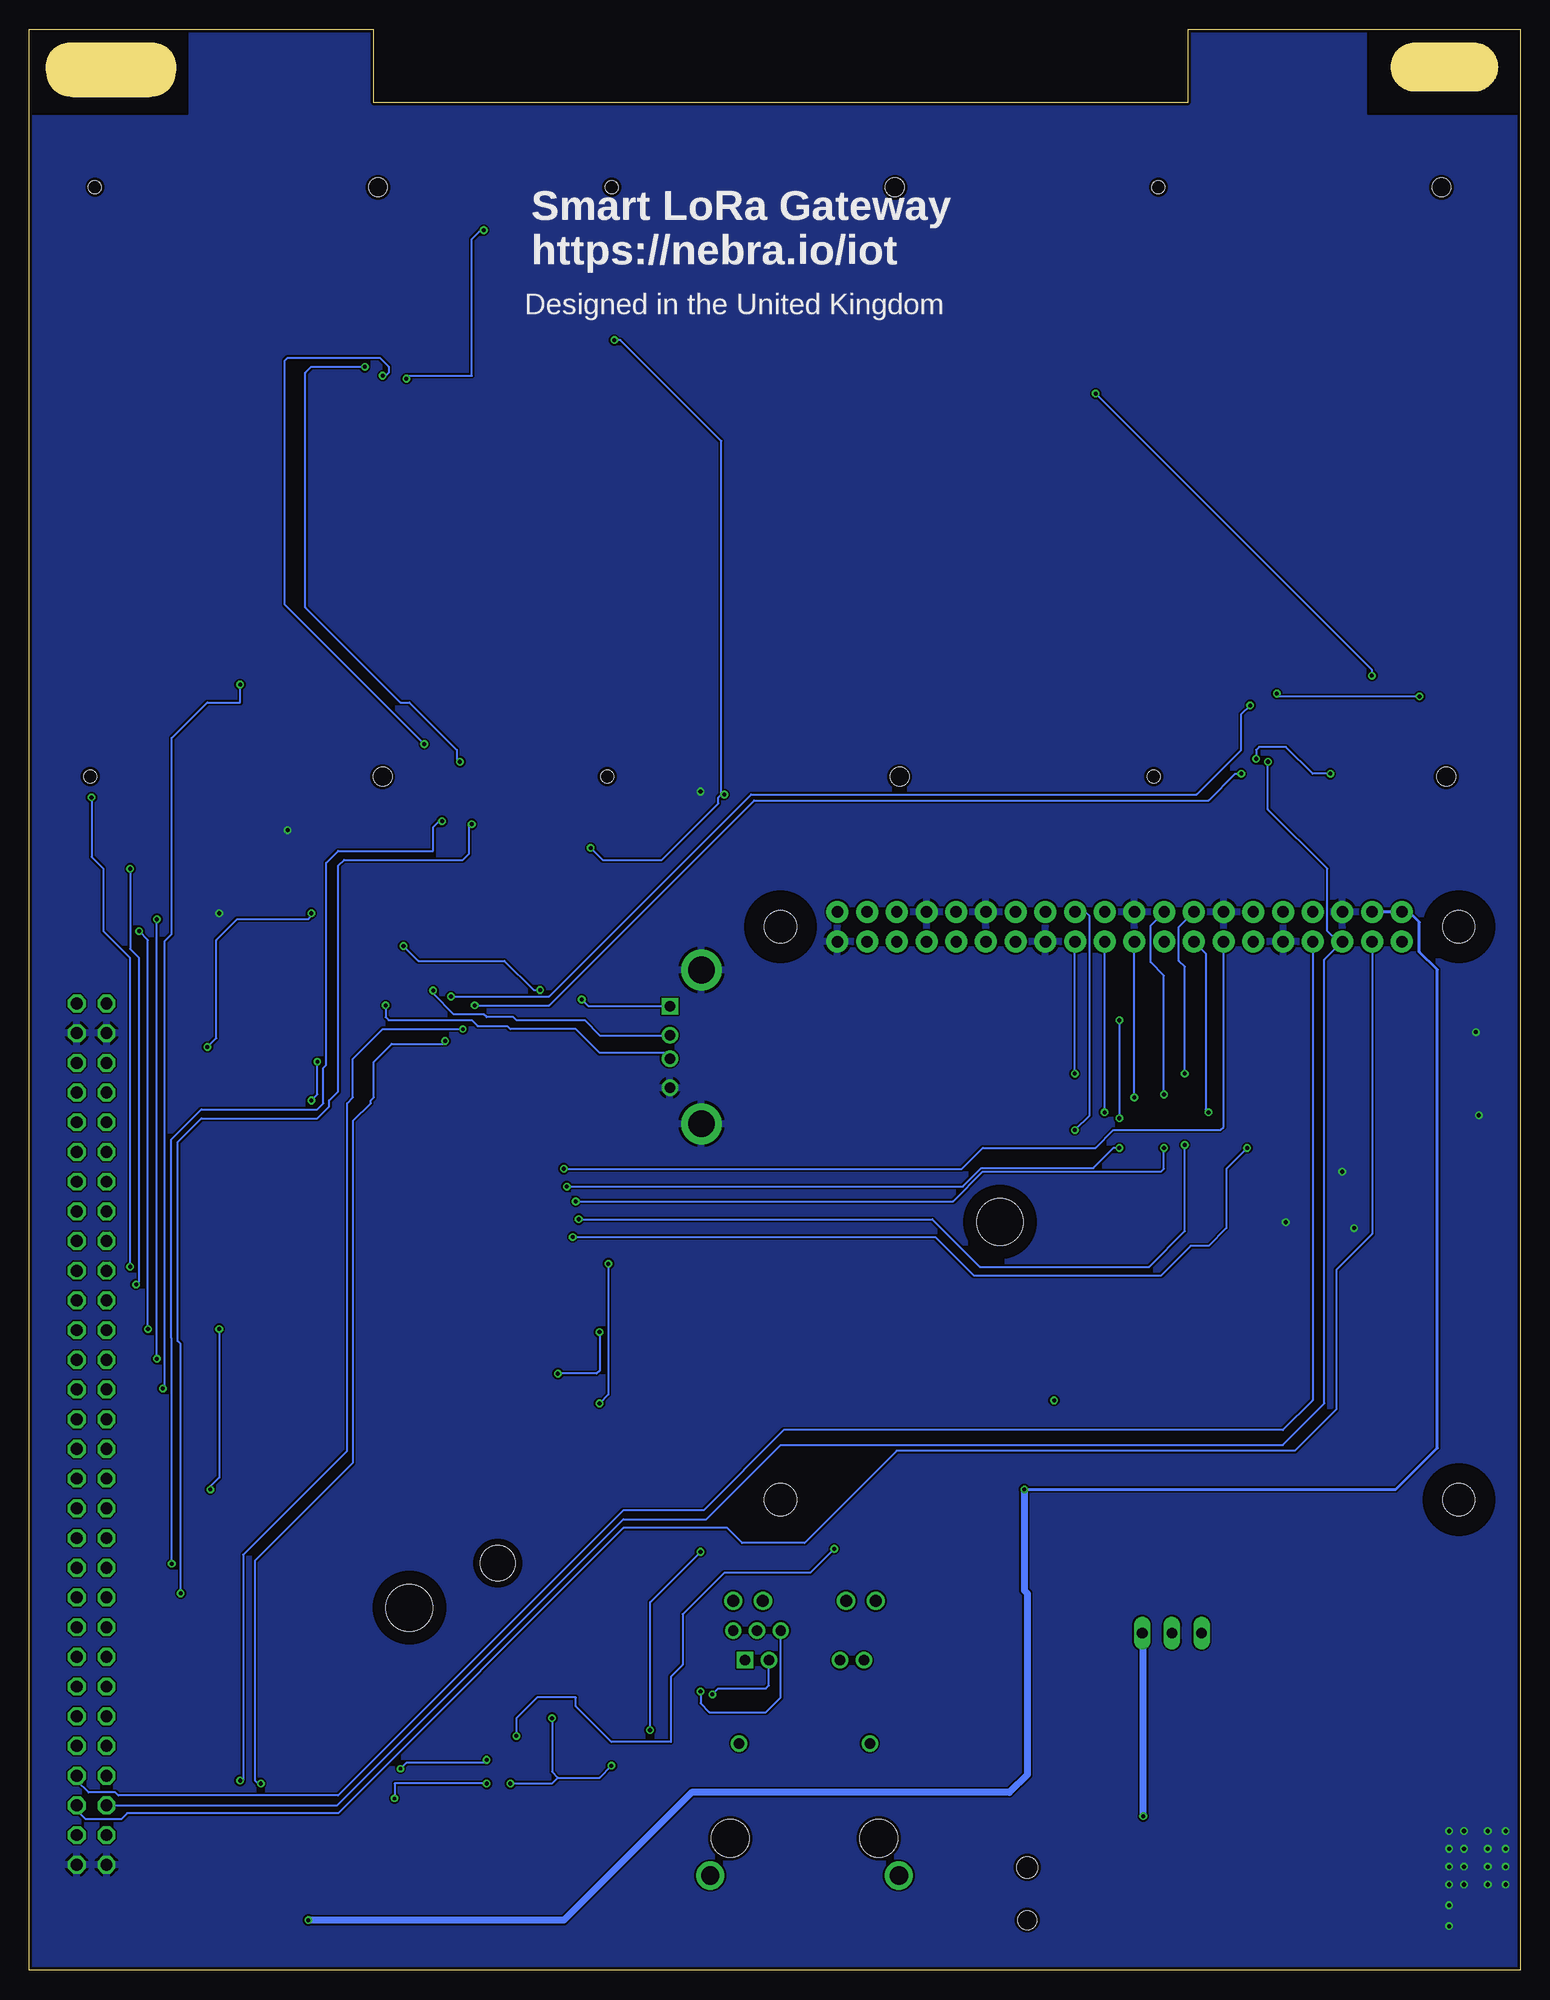
[diagram p6: board, bottom side, seen from below]

Size 127.5 x 166 mm. Coordinates in mm from the lower left corner, seen from the top.
Outline: 0,0 127.5,0 127.5,166 98.04,166 98.04,159.74 28.45,159.74 28.45,166 0,166 0,0
Copper layers (1*16): Top 0.035mm / dielectric 1.5mm / Bottom 0.035mm
Design rules "dirt_cheap_dirty_boards.v1.1": minimum track width 6mil, minimum drill 12mil, track to track 6mil, track to pad 6mil, pad to pad 6mil, via to via 6mil, smd to smd 0mil, copper to edge 10mil, drill to drill 10mil, minimum pad ring 10mil, minimum via ring 6mil, stop-mask expansion 2mil, vias tented up to drill 25mil, thermal gap 10mil
Holes 4 mm at 44.5,64 95,31
tRestrict: area 41.4,60.9 to 47.6,67.1; area 0,158.8 to 13,165.8; area 114,158.8 to 128,165.8; area 114,158.8 to 128,165.8; area 91.9,27.9 to 98.1,34.1
bRestrict: area 41.4,60.9 to 47.6,67.1; area 0,158.8 to 13,165.8; area 114,158.8 to 128,165.8; area 91.9,27.9 to 98.1,34.1
Milling: 3 lines

### Footprints (pad centres in the part's own frame; a part is rotated, then mirrored left to right if it is on the bottom)
SOIC-4 = smd 1.2 x 1.2: + 1.3,3.05; - -1.3,3.05; ~1 -1.3,-3.05; ~2 1.3,-3.05
C0603 = smd 1.1 x 1: 1 -0.85,0; 2 0.85,0
PANASONIC_E = smd 3.8 x 1.4: + 3,0; - -3,0
SOD-123_MINI-SMA = smd 1.5 x 2.1: A 1.8,0; C -1.8,0
SMB = smd 2.4 x 2.4: A 2.2,0; C -2.2,0
LED-0603 = smd 1 x 1: A -0.877,0; C 0.877,0
DO-214AA = smd 2.159 x 2.743: P$1 -2.21,0; P$2 2.21,0
SO-08 = smd 0.6 x 2.2: 1 -1.905,-2.6; 2 -0.635,-2.6; 3 0.635,-2.6; 4 1.905,-2.6; 5 1.905,2.6; 6 0.635,2.6; 7 -0.635,2.6; 8 -1.905,2.6
QFN50P500X500X100-33N = smd 0.8 x 0.3: 1 -2.5,1.75; 2 -2.5,1.25; 3 -2.5,0.75; 4 -2.5,0.25; 5 -2.5,-0.25; 6 -2.5,-0.75; 7 -2.5,-1.25; 8 -2.5,-1.75; 17 2.5,-1.75; 18 2.5,-1.25; 19 2.5,-0.75; 20 2.5,-0.25; 21 2.5,0.25; 22 2.5,0.75; 23 2.5,1.25; 24 2.5,1.75 | smd 0.3 x 0.8: 9 -1.75,-2.5; 10 -1.25,-2.5; 11 -0.75,-2.5; 12 -0.25,-2.5; 13 0.25,-2.5; 14 0.75,-2.5; 15 1.25,-2.5; 16 1.75,-2.5; 25 1.75,2.5; 26 1.25,2.5; 27 0.75,2.5; 28 0.25,2.5; 29 -0.25,2.5; 30 -0.75,2.5; 31 -1.25,2.5; 32 -1.75,2.5 | smd 3.8 x 3.8: 33 0,0
SOT-223-3 = smd 1.219 x 2.235: 1 -2.311,-3.099; 2 0,-3.099; 3 2.311,-3.099 | smd 3.6 x 2.2: 4 0,3.099
AMPHENOL_UE27-AE54-100_0 = drill 0.9 pad 1.4 square: 1 -3.5,1.36 | drill 0.9 pad 1.4: 2 -1,1.36; 3 1,1.36; 4 3.5,1.36 | drill 2.3 pad 3.5: 5 -6.57,-1.35; 6 6.57,-1.35
BEL_0826-1L1T-57-F_0 = drill 0.89 pad 1.39 square: 1 -5.08,-9.78 | drill 0.89 pad 1.39: 2 -3.048,-9.78; 5 3.048,-9.78; 6 5.08,-9.78; 7 -6.096,-12.32; 8 -4.064,-12.32; 9 -2.032,-12.32; 10 -5.588,-2.668; 11 5.588,-2.668 | drill 1.02 pad 1.57: 12 -6.096,-14.86; 13 -3.556,-14.86; 14 3.556,-14.86; 15 6.096,-14.86 | drill 1.57 pad 2.42: 16 -8.065,8.635; 17 8.065,8.635 | hole 3.25: 6.35,5.46; -6.35,5.46
CONN_78646-3001 = smd 1.15 x 0.65: C1 -7.26,2.645; C2 -7.26,0.105; C3 -7.26,-2.435; C5 -7.26,3.915; C6 -7.26,1.375; C7 -7.26,-1.165 | smd 1.3 x 0.45: G1 -5.09,6.16; G2 -3.09,6.16; G3 -5.09,-6.38; G4 -3.09,-6.38 | smd 1.7 x 1.4: G5 6.47,-6.215; G6 6.47,5.995 | smd 0.8 x 0.54: X1 5.89,2.43; X2 5.89,-2.65
JP2 = drill 0.914 long: 1 -2.54,0; 2 0,0; 3 2.54,0
INDPM115100X410N = smd 2.8 x 3.05: 1 -4.9,0; 2 4.9,0
L2012C = smd 1 x 1: 1 -1,0; 2 1,0
CHIPLED_0603 = smd 0.8 x 0.8: A 0,-0.75; C 0,0.75
R0603 = smd 1 x 1.1: 1 -0.85,0; 2 0.85,0
SO08 = smd 0.6 x 2.2: 1 -1.905,-2.6; 2 -0.635,-2.6; 3 0.635,-2.6; 4 1.905,-2.6; 5 1.905,2.6; 6 0.635,2.6; 7 -0.635,2.6; 8 -1.905,2.6
AG9800 = smd 1.93 x 3.81: P$1 1.27,-1.27; P$2 3.81,-1.27; P$3 21.59,-1.27; P$4 24.13,-1.27; P$5 24.13,19.05; P$6 21.59,19.05; P$7 3.81,19.05; P$8 1.27,19.05
FE1.1S_SSOP-28 = smd 0.35 x 1.5: 1 -4.16,-2.7; 2 -3.52,-2.7; 3 -2.88,-2.7; 4 -2.24,-2.7; 5 -1.6,-2.7; 6 -0.96,-2.7; 7 -0.32,-2.7; 8 0.32,-2.7; 9 0.96,-2.7; 10 1.6,-2.7; 11 2.24,-2.7; 12 2.88,-2.7; 13 3.52,-2.7; 14 4.16,-2.7; 15 4.16,2.7; 16 3.52,2.7; 17 2.88,2.7; 18 2.24,2.7; 19 1.6,2.7; 20 0.96,2.7; 21 0.32,2.7; 22 -0.3,2.7; 23 -0.96,2.7; 24 -1.6,2.7; 25 -2.24,2.7; 26 -2.88,2.7; 27 -3.52,2.7; 28 -4.16,2.7
2X30 = drill 1.016 octagon: 1 -38.1,-1.27; 2 -38.1,1.27; 3 -35.56,-1.27; 4 -35.56,1.27; 5 -33.02,-1.27; 6 -33.02,1.27; 7 -30.48,-1.27; 8 -30.48,1.27; 9 -27.94,-1.27; 10 -27.94,1.27; 11 -25.4,-1.27; 12 -25.4,1.27; 13 -22.86,-1.27; 14 -22.86,1.27; 15 -20.32,-1.27; 16 -20.32,1.27; 17 -17.78,-1.27; 18 -17.78,1.27; 19 -15.24,-1.27; 20 -15.24,1.27; 21 -12.7,-1.27; 22 -12.7,1.27; 23 -10.16,-1.27; 24 -10.16,1.27; 25 -7.62,-1.27; 26 -7.62,1.27; 27 -5.08,-1.27; 28 -5.08,1.27; 29 -2.54,-1.27; 30 -2.54,1.27; 31 0,-1.27; 32 0,1.27; 33 2.54,-1.27; 34 2.54,1.27; 35 5.08,-1.27; 36 5.08,1.27; 37 7.62,-1.27; 38 7.62,1.27; 39 10.16,-1.27; 40 10.16,1.27; 41 12.7,-1.27; 42 12.7,1.27; 43 15.24,-1.27; 44 15.24,1.27; 45 17.78,-1.27; 46 17.78,1.27; 47 20.32,-1.27; 48 20.32,1.27; 49 22.86,-1.27; 50 22.86,1.27; 51 25.4,-1.27; 52 25.4,1.27; 53 27.94,-1.27; 54 27.94,1.27; 55 30.48,-1.27; 56 30.48,1.27; 57 33.02,-1.27; 58 33.02,1.27; 59 35.56,-1.27; 60 35.56,1.27 | hole 3: 9.77,-34.71
UBLOX_NEO-6P = smd 1.8 x 0.8: 1_RESERVED 6.4,-7.4; 2_SS_N 6.4,-6.3; 3_TIMEPULSE 6.4,-5.2; 4_EXTINT0 6.4,-4.1; 5_USB_DM 6.4,-3; 6_USB_DP 6.4,-1.9; 7_VDDUSB 6.4,-0.8; 8_RESERVED 6.4,2.2; 9_VCC_RF 6.4,3.3; 10_GND 6.4,4.4; 11_RF_IN 6.4,5.5; 12_GND 6.4,6.6; 13_GND -5.6,6.6; 14_MOSI/CFG_COM0 -5.6,5.5; 15_MISO/CFG_COM1 -5.6,4.4; 16_CFG_CPS0/SCK -5.6,3.3; 17_RESERVED -5.6,2.2; 18_SDA2 -5.6,-0.8; 19_SCL2 -5.6,-1.9; 20_TXD1 -5.6,-3; 21_RXD1 -5.6,-4.1; 22_V_BCKP -5.6,-5.2; 23_VCC -5.6,-6.3; 24_GND -5.6,-7.4
RASPBERRY-PI-PLUS = drill 0.97 pad 1.88: 1 -34.13,23.23; 2 -34.13,25.77; 3 -31.59,23.23; 4 -31.59,25.77; 5 -29.05,23.23; 6 -29.05,25.77; 7 -26.51,23.23; 8 -26.51,25.77; 9 -23.97,23.23; 10 -23.97,25.77; 11 -21.43,23.23; 12 -21.43,25.77; 13 -18.89,23.23; 14 -18.89,25.77; 15 -16.35,23.23; 16 -16.35,25.77; 17 -13.81,23.23; 18 -13.81,25.77; 19 -11.27,23.23; 20 -11.27,25.77; 21 -8.73,23.23; 22 -8.73,25.77; 23 -6.19,23.23; 24 -6.19,25.77; 25 -3.65,23.23; 26 -3.65,25.77; 27 -1.11,23.23; 28 -1.11,25.77; 29 1.43,23.23; 30 1.43,25.77; 31 3.97,23.23; 32 3.98,25.77; 33 6.51,23.23; 34 6.51,25.77; 35 9.05,23.23; 36 9.05,25.77; 37 11.59,23.23; 38 11.59,25.77; 39 14.13,23.23; 40 14.13,25.77 | hole 2.75: -39,24.5; 19,24.5; -39,-24.5; 19,-24.5
DCJACK_2MM_SMT = smd 2.4 x 2: GND 0,-5.5; GNDBREAK 6.2,-5.5; PWR1 0,5.5; PWR2 6.2,5.5 | hole 1.6: 0,0 | hole 1.8: 4.5,0
679105700 = smd 0.6 x 2: 1 0.7,-4.1; 2 1.1,4.1; 3 1.5,-4.1; 4 1.9,4.1; 5 2.3,-4.1; 6 2.7,4.1; 7 3.1,-4.1; 8 3.5,4.1; 9 3.9,-4.1; 10 4.3,4.1; 11 4.7,-4.1; 12 5.1,4.1; 13 5.5,-4.1; 14 5.9,4.1; 15 6.3,-4.1; 16 6.7,4.1; 17 10.3,-4.1; 18 10.7,4.1; 19 11.1,-4.1; 20 11.5,4.1; 21 11.9,-4.1; 22 12.3,4.1; 23 12.7,-4.1; 24 13.1,4.1; 25 13.5,-4.1; 26 13.9,4.1; 27 14.3,-4.1; 28 14.7,4.1; 29 15.1,-4.1; 30 15.5,4.1; 31 15.9,-4.1; 32 16.3,4.1; 33 16.7,-4.1; 34 17.1,4.1; 35 17.5,-4.1; 36 17.9,4.1; 37 18.3,-4.1; 38 18.7,4.1; 39 19.1,-4.1; 40 19.5,4.1; 41 19.9,-4.1; 42 20.3,4.1; 43 20.7,-4.1; 44 21.1,4.1; 45 21.5,-4.1; 46 21.9,4.1; 47 22.3,-4.1; 48 22.7,4.1; 49 23.1,-4.1; 50 23.5,4.1; 51 23.9,-4.1; 52 24.3,4.1 | smd 2.3 x 3.2: M1 27.15,-3.5; M2 -2.15,-3.5 | smd 4.8 x 3: M3 0.4,47.25; M4 0.4,53.55; M5 24.6,47.25; M6 24.6,53.55 | hole 1.6: 0,0; 0.4,50.4 | hole 1.1: 25,0; 24.6,50.4
U.FL = smd 2.2 x 1.05: 1 0,1.375; 2 0,-1.375 | smd 0.8 x 1: 3 1.525,0
HC49UP = smd 5.334 x 1.93: 1 -4.826,0; 2 4.826,0

### Placement (x,y rotation side)
B1  42.08,27.23 90 top
B2  42.16,20.04 90 top
C1  18.97,51.44 90 top
C2  18.29,65.5 90 top
C3  17.78,42.39 0 top
C4  18.54,55.6 0 top
C5  30.57,38.32 0 top
C6  12.62,38.75 90 top
C7  113.79,7.08 270 top
C8  40.89,119.6 270 top
C9  51.31,109.19 0 top
C10  92.2,109.44 0 top
C11  2.29,109.95 270 top
C12  89.06,75.99 0 top
C13  89.06,78.45 0 top
C14  107.18,88.44 180 top
C15  107.18,91.06 180 top
C16  111.41,83.36 0 top
C17  111.41,85.73 0 top
C18  73.92,17.92 180 top
C19  92.12,18.43 0 top
C20  92.12,15.72 0 top
C21  87.04,7.85 180 top
C22  87.55,25.53 180 top
C23  78.65,25.55 0 top
C29  73.91,31.97 180 top
C31  45.91,36.17 90 top
C33  36.83,36.12 90 top
C34  15.67,31.55 180 top
C36  91.19,155.42 270 top
C37  36.83,137.89 90 top
C38  44.7,105.38 0 top
C39  40.64,108.43 0 top
D1  36.83,43.83 0 top
D2  37.34,58.06 0 top
D3  23.54,38.07 0 top
D4  36.1,53.18 0 top
D5  35.18,65.78 0 top
D6  7.86,33.16 270 top
D7  29.21,20.29 90 top
IC1  88.39,149.58 270 top
IC2  82.3,16.32 180 top
IC3  40.64,99.79 0 top
J1  71.37,78.96 270 top
J2  61.21,16.73 180 top
J3  41.66,151.1 90 top
JP1  29.8,28.84 0 top
L1  27.69,48.74 90 top
L2  27.94,62.96 90 top
L3  83.82,122.91 270 top
LED1  92.96,123.67 270 top
R1  95.09,73.03 90 top
R2  107.01,76.42 180 top
R3  107.18,83.19 180 top
R4  107.18,85.73 180 top
R5  3.52,32 0 top
R6  107.01,78.79 0 top
R7  107.01,80.82 0 top
R8  86.61,122.91 270 top
R9  73.91,35.28 0 top
R10  90.17,123.16 270 top
R12  55.8,35.87 180 top
R15  41.15,138.15 90 top
R16  45.97,137.89 90 top
R17  43.43,131.8 90 top
R18  38.1,132.3 0 top
R19  40.06,51.73 90 top
R20  35.35,68.38 0 top
R21  68.07,36.13 180 top
R22  87.04,2.26 0 top
R23  87.04,5.06 0 top
R24  92.12,13.01 0 top
R25  83.23,25.29 0 top
U1  12.36,59.66 90 top
U2  12.36,47.98 90 top
U$1  4.15,26.3 270 top
U$2  97.95,81.58 270 top
U$3  122.16,44.58 270 top
U$4  87.62,134.34 180 top
U$5  44.27,64.74 0 top
U$6  [FCC_20X8.35MM]  124.19,116.38 90 top
U$7  [CE_5MM]  123.94,137.89 90 top
U$8  42.16,4.29 90 top
X1  53.09,102.08 0 top
X2  6.35,102.08 0 top
X3  97.28,102.08 0 top
X4  85.33,113.37 90 top
Y2  86.62,89.12 0 top
Y3  83.15,29.78 0 top

### Tracks (layer width: path | path; a pad name or v marks a point on that pad's centre or on a via)
12VRAW
  Top 0.254: 29.8,38.23 C5.1 29.59,38.2
  Top 0.61: D3.A 29.47,38.07 29.59,38.2 | 29.8,38.23 JP1.2
+1V5  (via drill 0.35)
  Top 0.152: X2.6 9.05,108.78 8.89,108.94 v8.64,108.94 | X2.28 21.05,108.97 v20.83,109.19 21.08,108.94 28.7,108.94 29.05,108.59 | X2.48 29.05,108.59 | 29.05,108.59 39.63,108.59 C39.1 40.64,107.58 40.64,103.09 IC3.4 IC3.2
  Bottom 0.152: v8.64,108.94 20.83,108.94 v20.83,109.19
+3V3
  Top 0.152: U$5.17 31.36,87.97 31.75,88.36 31.75,94.2
  Top 0.254: R9.2 74.76,36.46 73.41,37.82 66.8,37.82 64.77,35.78 J2.13 62.87,31.59 61.47,30.2 56.54,30.2 55.27,31.47 55.24,31.47 J2.15 | 21.59,66.26 21.59,67.03 18.54,70.07 11.43,70.07 10.14,71.36 U$5.1 8.64,89.48 8.64,93.19 7.62,94.2 1.52,94.2 | 111.51,103.86 112.78,103.86 116.38,100.25 X3.39 X3.41 117.18,100.39 121.58,104.79 X3.52 | 111.51,103.86 110.38,104.98 X3.24 | 111.51,103.86 111.25,103.6 98.81,103.6 98.38,104.03 X3.2 98.3,106.26 98.3,109.44 C10.2 | C10.2 93.05,119.43 R10.2 100.5,122.31 100.58,122.4 100.58,139.92 99.86,140.64 96.27,140.64 | U$4.23_VCC 96.27,140.64 | C10.2 93.05,108.52 92.71,108.17 77.47,108.17 77.39,108.09 X1.52 77.39,103.77 77.22,103.6 75.95,103.6 72.99,100.64 X1.41 X1.39 72.19,100 68.83,103.35 66.8,103.35 66.19,103.96 X1.24 66.19,108.03 65.53,108.68 54.61,108.68 | X1.2 54.19,108.26 54.61,108.68 | 54.61,108.68 54.1,109.19 C9.2 52.16,108.52 51.31,107.67 45.21,107.67 44.45,107.67 43.85,107.07 C38.1 43.85,97.6 IC3.3 43.18,96.47 43.18,94.2 31.75,94.2 28.19,94.2 26.25,96.15 X2.41 26.25,98.01 | 26.25,98.01 26.25,100.64 29.21,103.6 29.97,103.6 30.65,104.28 X2.52 | X2.24 19.45,103.86 | 19.45,103.86 19.45,103.2 22.1,100.55 24.89,100.55 25.45,100 X2.39 25.49,98.01 26.25,98.01 | 19.45,103.86 18.54,103.86 17.78,103.09 8.13,103.09 7.45,103.77 X2.2 4.28,106.18 3.3,107.16 | C11.2 2.29,108.17 3.3,107.16 | 18.29,62.71 1.52,79.47 1.52,94.2 | 3.3,107.16 1.52,105.38 1.52,94.2 | C36.2 91.19,151.68 IC1.8 92.84,151.48 93.73,150.59 93.73,145 96.27,142.46 96.27,140.64
  Top 0.305: C8.+ 45.21,112.29 45.21,107.67
  Top 0.61: U1.3 18.29,60.29 | 18.29,60.29 19.43,60.29 21.59,62.45 21.59,66.26 23.19,67.86 L2.2 30.66,67.86 32.74,65.78 D5.A 34.31,63.45 36.83,60.93 41.91,60.93 46.23,56.61 46.23,38.88 | C2.1 18.29,62.71 18.29,60.29 | 46.23,38.88 C31.+ | J2.15 52.58,34.13 52.58,34.26 47.96,38.88 46.23,38.88
+5V  (via drill 0.35)
  Top 0.152: 112.27,80.74 v112.27,78.96 | v103.38,90.39 98.3,90.39 v95.5,87.6 | v83.82,83.84 81.07,83.84 v80.26,83.03
  Top 0.254: IC2.7 85.92,17.57 86.61,18.26 86.61,18.51 86.87,18.77 90.94,18.77 C19.1 91.27,16.99 | 91.27,16.99 C20.1 | 91.27,16.99 94.74,16.99 94.74,9.11 97.79,6.07 103.89,6.07 104.65,5.3 104.65,4.29 104.65,3.27 103.64,2.26 R22.2 | R4.1 C17.1 110.56,84.3 | 110.56,84.3 C16.1 | C16.1 | R3.1 108.2,83.36 C16.1 | R6.2 110.24,78.79 | 110.24,78.79 110.31,78.79 110.56,79.04 110.56,80.74 | 110.56,80.74 C16.1 | R2.1 109.72,76.42 110.24,76.93 110.24,78.79 | 111.51,80.74 110.56,80.74 | U$2.20 102.24,80.62 104.9,83.28 104.9,84.04 105.16,84.3 110.56,84.3 | v39.88,48.74 39.37,48.23 39.37,47.72
  Top 0.305: U$3.1 115.22,82.68 113.28,80.74 112.27,80.74 111.51,80.74
  Top 0.61: U2.3 18.41,48.61 18.97,49.16 C1.1 24.64,50.59 L1.2 34.77,53.64 D4.A 35.23,50.09 37.59,47.72 39.37,47.72 40.39,47.72 41.66,46.45 41.66,41.12 | U$3.1 U$3.2 124.81,82.68 125.73,81.76 125.73,5.3 124.51,4.08 C7.+ 113.59,4.29 104.65,4.29 v103.63,4.29 | C33.+ 38.82,41.12 41.66,41.12 | 41.66,41.12 v42.42,41.12
  Bottom 0.152: v112.27,78.96 111.51,79.73 111.51,88.11 109.73,89.89 103.63,89.89 103.38,90.14 v103.38,90.39 | v95.5,87.6 94.23,86.33 86.87,86.33 84.38,83.84 v83.82,83.84 | v80.26,83.03 79.7,82.46 J1.1
  Bottom 0.254: v42.42,41.12 10.67,41.12 7.11,44.67 7.11,85.57 8.64,87.09 8.64,89.63 9.52,90.51 U$5.2 U$5.4
  Bottom 0.61: v42.42,41.12 42.42,32.48 42.16,32.23 42.16,16.73 43.69,15.21 70.87,15.21 81.79,4.29 v103.63,4.29
+12V
  Top 0.254: 12.7,37.82 C6.1 | 15.16,45.87 U2.1 | 21.08,37.82 D3.C | U1.1 14.99,57.75 | 15.24,57.75 15.53,57.75 | D6.A 11.8,34.04
  Top 0.305: 11.8,34.04 12.67,33.17 C34.+
  Top 0.61: 17.02,38.07 D3.C | 17.02,38.07 16.93,38.16 C3.1 16.93,45.52 16.38,46.07 U2.1 12.57,46.07 12.45,46.2 12.45,57.37 12.83,57.75 14.99,57.75 | 14.99,57.75 15.24,57.75 | C4.1 15.24,55.6 14.99,55.85 14.99,57.75 | C34.+ 16.14,35.02 16.51,35.02 17.02,35.53 17.02,38.07 | C6.1 12.79,38.07 17.02,38.07
CAP_LINKS  (via drill 0.35)
  Top 0.152: IC2.20 77.72,16.57 | 77.72,16.57 76.62,16.57 75.26,17.92 C18.1 | IC2.3 85.95,15.57 v86.36,15.97 | v77.72,17.5 77.72,16.57 | IC2.11 83.05,21.31 v82.8,21.56
  Bottom 0.152: v86.36,15.97 82.8,15.97 82.3,16.48 | 82.3,16.48 82.8,16.99 v82.8,21.56 | 82.3,16.48 78.74,16.48 v77.72,17.5
CM_USB_N
  Top 0.152: U$2.15 101.9,76.17 103.63,76.17 103.63,75.66 104.39,74.9 112.52,74.9 112.52,75.15 113.03,75.66 118.62,75.66 118.62,75.92 120.31,77.6 U$3.5
CM_USB_P  (via drill 0.3, 0.35)
  Top 0.152: U$2.16 102.25,78.06 102.62,77.69 v102.87,77.69 | U$3.7 113.45,75.06 112.78,74.39 v103.38,74.39
  Bottom 0.152: v102.87,77.69 102.87,74.9 v103.38,74.39
CT
  Top 0.152: R9.1 C29.2 70.14,29.05 J2.7
ETH_DM  (via drill 0.3, 0.35)
  Top 0.152: IC2.5 87.8,16.57 v88.39,15.97 | v96.27,14.7 96.27,13.94 96.52,13.69 96.52,9.37 98.81,7.08 108.2,7.08 109.47,8.35 v109.47,16.23 | v90.42,80.49 90.68,80.23 92.96,80.23
  Top 0.203: U$2.10 93.22,79.98 92.96,80.23
  Bottom 0.152: v88.39,15.97 96.27,15.97 v96.27,14.7 | v90.42,80.49 97.28,80.49 99.82,77.95 99.82,74.65 100.33,74.14 100.33,44.42 109.22,35.53 109.22,16.23 v109.47,16.23
ETH_DP  (via drill 0.3, 0.35)
  Top 0.152: IC2.6 84.88,16.99 87.88,16.99 88.39,17.5 v88.39,18 | 92.46,79.73 92.2,79.73 v91.95,79.47 | v95.76,17.24 98.81,14.19 98.81,8.35 99.31,7.84 107.19,7.84 107.7,8.35 v107.7,15.97
  Top 0.203: U$2.11 92.84,79.34 92.46,79.73
  Bottom 0.152: v91.95,79.47 91.95,79.22 96.52,79.22 98.04,77.69 98.04,74.65 98.3,74.39 98.3,74.14 99.82,72.61 99.82,43.4 108.2,35.02 108.2,16.23 107.95,15.97 v107.7,15.97 | v88.39,18 88.65,17.75 95.25,17.75 v95.76,17.24
GND  (via drill 0.35)
  other vias: 111.25,90.39 105.41,97.51 70.1,100.81 1.27,7.34 2.79,7.34 4.83,7.34 6.1,7.34 6.1,5.56 6.1,3.78 15.24,68.3 3.56,73.12 3.81,80.23 20.07,63.98 14.22,63.47 1.27,11.91 2.79,11.91 4.83,11.91 6.1,11.91 6.1,10.38 6.1,8.86 4.83,8.86 2.79,8.86 1.27,8.86 1.27,10.38 2.79,10.38 4.83,10.38
  pour Top (no thermals): -12.7,-21.62 -12.7,169.22 8.13,190.04 132.67,190.04 144.78,177.94 144.78,-11.46 130.81,-25.43 -8.89,-25.43
  pour Bottom: -10.35,-20.41 -10.35,178.42 5.5,194.28 133.52,194.28 146.81,180.98 146.81,-9.94 132.84,-23.91 -6.86,-23.91
GPIO_4
  Bottom 0.152: U$5.7 17.76,48.76 20.32,46.2 62.99,46.2 69.85,39.34 76.71,39.34 101.09,14.96 119.89,14.96 120.14,15.21 122.43,15.21 123.43,16.21 U$3.54
GPIO_8  (via drill 0.35)
  Top 0.152: U$3.50 122.25,20.54 113.28,20.54 113.16,20.42 102.87,30.7 102.87,38.07 102.11,38.83 78.99,38.83 45.97,71.85 v38.1,71.85
  Bottom 0.152: v38.1,71.85 36.83,73.12 36.83,90.14 37.2,90.51 U$5.24
GPIO_9  (via drill 0.35)
  Top 0.152: U$3.48 122.25,23.08 112.78,23.08 104.39,31.47 104.39,38.32 103.12,39.59 78.99,39.59 69.34,49.25 45.21,73.38 v35.56,73.38
  Bottom 0.152: v35.56,73.38 35.54,73.39 U$5.21
GPIO_10  (via drill 0.35)
  Top 0.152: U$3.46 122.25,25.62 113.03,25.62 105.16,33.5 105.16,39.09 104.14,40.1 78.99,40.1 69.34,49.75 44.45,74.65 v33.02,74.65
  Bottom 0.152: v33.02,74.65 33,74.66 U$5.19
GPIO_11  (via drill 0.35)
  Top 0.152: U$3.44 122.25,28.16 113.03,28.16 106.43,34.77 106.43,39.59 105.16,40.86 78.99,40.86 43.18,76.68 v38.1,76.68
  Bottom 0.152: v38.1,76.68 38.1,87.95 U$5.23
GPIO_14
  Top 0.152: U$3.38 122.25,35.78 113.03,35.78 106.93,41.88 78.74,41.88 68.71,51.91 42.93,77.69 20.07,77.69 19.05,78.71 19.05,89.38 17.91,90.51 U$5.8
GPIO_15
  Top 0.152: U$3.36 122.25,38.32 112.78,38.32 108.46,42.64 78.74,42.64 42.93,78.46 20.83,78.46 20.57,78.71 20.57,85.82 21.59,86.84 21.59,89.22 U$5.10
GPIO_17
  Top 0.152: U$3.32 122.25,43.4 79.25,43.4 43.69,78.96 23.62,78.96 22.84,79.74 U$5.11
GPIO_18
  Top 0.152: U$3.30 123.1,47.12 121.92,45.94 77.47,45.94 43.43,79.98 24.13,79.98 24.13,89.89 23.5,90.51 U$5.12
GPIO_22  (via drill 0.35)
  Top 0.152: U$3.22 123.43,57.11 122.43,56.1 111.25,56.1 103.89,63.47 81.79,63.47 v81.03,62.71 | v26.67,73.38 24.13,70.84 23.88,70.84 v23.37,70.33
  Bottom 0.152: v81.03,62.71 50.04,62.71 46.74,59.41 30.73,59.41 28.19,61.95 26.67,61.95 25.15,63.47 25.15,68.55 v23.37,70.33 | U$5.15 26.92,86.97 26.92,73.63 v26.67,73.38
GPIO_23  (via drill 0.35)
  Top 0.152: U$3.20 122.43,58.82 122.43,58.64 119.63,58.64 118.67,59.61 118.64,59.61 118.59,59.66 108.97,59.66 104.14,64.49 80.77,64.49 v80.52,64.23 | v28.7,70.58 v28.7,76.68
  Bottom 0.152: v80.52,64.23 50.29,64.23 46.23,60.17 31.75,60.17 28.7,63.22 v28.7,70.58 | v28.7,76.68 28.7,85.82 29.21,86.33 29.21,89.22 U$5.16
GPIO_24  (via drill 0.35)
  Top 0.152: U$3.18 122.43,61.36 122.43,61.18 108.97,61.18 104.39,65.76 v80.77,65.76 | v30.48,70.33 v30.48,74.9
  Bottom 0.152: v80.77,65.76 48.51,65.76 45.97,68.3 30.73,68.3 30.48,68.55 v30.48,70.33 | v30.48,74.9 30.48,85.06 31.63,86.21 31.63,89.34 U$5.18
GPIO_25  (via drill 0.35)
  Top 0.152: U$3.16 122.25,63.72 107.95,63.72 104.9,66.77 81.79,66.77 v81.53,67.03 | U$5.22 34.29,89.26 v34.29,81.25 | v34.29,72.87 v34.29,70.33
  Bottom 0.152: v81.53,67.03 47.67,67.03 46.1,68.6 36.52,68.6 34.8,70.33 v34.29,70.33 | v34.29,81.25 v34.29,72.87
GPIO_27  (via drill 0.35)
  Top 0.152: U$3.13 113.12,67.44 112.52,68.04 82.3,68.04 v81.79,68.55
  Bottom 0.152: v81.79,68.55 47.75,68.55 45.97,70.33 36.32,70.33 34.8,71.85 25.65,71.85 25.38,72.12 U$5.13
GPS_PPS  (via drill 0.35)
  Top 0.152: X3.19 108.38,96.16 108.2,95.98 92.96,95.98 | 92.96,95.98 v79.5,95.98 | v68.07,100.55 64.52,100.55 64.26,100.3 64.26,98.05 X1.19 | v77.47,139.42 81.09,139.42 U$4.3_TIMEPULSE | 92.96,95.98
  Bottom 0.152: v79.5,95.98 78.49,94.97 73.41,94.97 68.58,99.79 68.58,100.3 68.33,100.55 | 68.33,100.55 v68.07,100.55 | 68.33,100.55 68.33,130.78 76.96,139.42 v77.47,139.42
GPS_RX  (via drill 0.35)
  Top 0.152: v92.2,98.27 92.2,103.35 v93.73,104.87 | U$3.39 115.66,34.42 v115.32,34.77 | v97.28,136.37 97.28,136.88 96.81,137.34 U$4.20_TXD1
  Bottom 0.152: v92.2,98.27 92.46,98.27 92.96,97.76 92.96,95.73 101.09,95.73 102.11,94.71 102.11,77.44 102.36,77.19 102.36,74.14 102.87,73.63 112.78,73.63 115.34,71.06 115.34,54.07 115.32,54.05 v115.32,34.77 | v93.73,104.87 105.66,116.81 105.66,137.64 105.41,137.89 97.54,137.89 96.77,137.13 96.77,136.62 97.03,136.37 v97.28,136.37
GPS_SCL  (via drill 0.35)
  Top 0.152: U$4.19_SCL2 93.35,136.11 v95.25,136.11 | v88.65,148.81 90.86,148.81 IC1.6
  Bottom 0.152: v95.25,136.11 95,136.37 89.66,136.37 89.66,148.05 88.9,148.81 v88.65,148.81
GPS_SDA
  Top 0.152: IC1.5 90.99,135.8 91.69,135.1 91.74,135.14 U$4.18_SDA2
GPS_TX  (via drill 0.35)
  Top 0.152: v90.68,103.35 90.68,99.54 89.66,98.52 v89.66,98.01 | U$3.41 114.64,31.88 114.55,31.97 v114.55,32.23 | v98.81,137.13 97.49,138.44 U$4.21_RXD1
  Bottom 0.152: v90.68,103.35 90.93,103.6 90.93,104.36 95,108.43 95.76,108.43 103.89,116.56 103.89,136.62 103.38,137.13 v98.81,137.13 | v89.66,98.01 89.92,97.76 89.92,95.47 90.42,94.97 100.58,94.97 101.09,94.46 101.09,75.15 101.85,74.39 101.85,73.88 102.87,72.87 112.78,72.87 114.81,70.84 114.81,53.82 114.55,53.56 v114.55,32.23
I2C1_SCL  (via drill 0.35)
  Top 0.152: v21.59,103.35 21.85,103.61 X2.30
  Bottom 0.152: v21.59,103.35 21.59,99.28 16.51,94.2 16.51,88.87 15.61,87.97 U$5.5 16.76,86.43 16.76,48.48 20.32,44.93 63.25,44.93 69.6,38.58 76.71,38.58 101.18,14.1 U$3.55
I2C1_SDA  (via drill 0.35)
  Top 0.152: U$5.3 13.9,89.19 13.9,93.88 14.99,94.97 14.99,101.32 16,102.33 v16.26,102.33 | v22.61,103.6 22.61,106.13 X2.32
  Bottom 0.152: v16.26,102.33 17.78,102.33 20.07,104.62 22.35,104.62 22.61,104.36 v22.61,103.6 | U$5.3 12.68,62.98 15.75,59.91 15.75,47.98 19.3,44.42 53.34,44.42 61.21,36.55 66.55,36.55 67.82,37.82 76.71,37.82 101.09,13.43 119.13,13.43 119.63,12.92 122.68,12.92 123.43,13.67 U$3.56
LED1-
  Top 0.152: R21.2 67.22,31.69 J2.12
LED2-
  Top 0.152: J2.14 57.66,34.87 R12.1
LORA_RS1
  Top 0.152: U$3.29 111.09,47.12 111,47.21 82.8,47.21 82.55,46.96 77.22,46.96 76.2,47.98 76.2,85.31 73.66,87.85 73.66,91.16 71.63,93.19 65.28,93.19 62.23,96.24 62.23,101.32 65.39,104.47 X1.22
LORA_RS2  (via drill 0.35)
  Top 0.152: v109.47,109.95 109.47,106.29 X3.22 | v116.08,49.75 116.17,49.66 U$3.27
  Bottom 0.152: v109.47,109.95 109.47,108.43 112.27,108.43 115.32,105.38 115.32,88.62 115.9,88.03 115.9,49.93 v116.08,49.75
N$1
  Top 0.305: U$1.P$1 2.8,25.12 2.79,25.12
  Top 0.61: 2.8,25.12 2.8,22.58 U$1.P$2 5.84,22.49 | U$1.P$1 2.88,26.89 | 2.88,26.89 2.88,27.74 3.98,28.84 9.65,28.84 | 9.65,28.84 JP1.1 | 5.84,22.49 7.28,22.49 7.37,22.58 | 9.65,26.89 9.65,24.86 8.64,23.85 | 9.65,26.89 9.65,28.84 | 7.37,22.58 8.51,23.72 8.64,23.85 | 2.88,26.89 5.84,26.89 | 5.84,26.89 7.37,26.89 | 7.37,26.89 8.64,26.89 | 8.64,26.89 9.65,26.89 | 5.84,26.89 5.84,22.49 | 7.37,26.89 7.37,22.58 | 8.64,26.89 8.64,23.85
N$2
  Top 0.254: D1.C
  Top 0.61: D1.C L1.1 | L1.1 | U2.2 17.91,47.34 21.41,43.83 L1.1
N$3  (via drill 0.35)
  Top 0.61: U$8.PWR2 34.99,12.16 32.26,12.16 v32.26,13.18
  Bottom 0.61: v32.26,13.18 32.26,28.76 JP1.3
N$4
  Top 0.254: L2.1
  Top 0.61: U1.2 26.98,59.02 L2.1 D2.C
N$5
  Top 0.152: L3.1 83.82,130.53 83.57,130.78 | U$4.9_VCC_RF 83.3,131.04 83.57,130.78 | U$4.8_RESERVED 83.22,132.14 83.57,131.8 83.57,130.78
N$6
  Top 0.254: D6.C 4.66,32.28 R5.2
N$7
  Top 0.152: LED1.C 99.82,123.67 100.08,123.41 100.08,139.16 99.69,139.54 U$4.22_V_BCKP
N$8
  Top 0.2: R17.1 43.85,130.95 45.21,132.3 45.21,134.34 43.69,135.86 43.18,135.86 42.82,136.22 J3.C7
N$9
  Top 0.254: D4.C 39.45,53.18 R19.2
N$10
  Top 0.2: R15.2 41.55,139.4 J3.C2
N$11
  Top 0.203: U$2.21 98.55,81.25 98.3,81 98.3,78.96 97.39,78.06 U$2.13 90.42,78.06 | C13.2 90.3,78.06 90.42,78.06 | C12.2 90.42,76.5 90.42,78.06
N$12
  Top 0.152: C15.2 C14.2 | C14.2
  Top 0.203: C14.2 103.35,88.44 U$2.28 99.23,85.74 97.79,84.3 97.79,79.22 97.28,78.71 U$2.12
N$13
  Top 0.2: J3.C3 44.09,141.55 45.97,139.67 R16.2
N$14
  Top 0.152: L3.2 84.09,121.91 85.94,123.76 R8.1
N$16
  Top 0.152: X4.3 86.61,116.18 86.61,119.35 | 86.61,119.35 R8.2 | U$4.11_RF_IN 81.12,128.75 78.99,128.75 78.99,120.11 79.76,119.35 86.61,119.35
N$17
  Top 0.152: R10.1 90.51,123.67 LED1.A
N$19
  Top 0.203: U$2.26 103.8,84.46 105.06,85.73 R4.2
N$20
  Top 0.203: U$2.14 95.09,77.26 R1.2
N$21
  Top 0.203: R3.2 103.12,79.98 U$2.19
N$22
  Top 0.203: U$2.18 103.5,79.34 104.98,80.82 R7.1 | R6.1 R7.1 | R7.1
N$23
  Top 0.152: D5.C 36.2,65.92 R20.2
N$24
  Top 0.203: U$2.17 104.15,78.7 105.16,77.69 105.16,76.68 105.42,76.42 R2.2
N$25
  Top 0.203: U$2.2 86.57,85.1 85.34,86.33 85.34,88.36 86.1,89.12 Y2.2
N$26
  Top 0.203: U$2.3 83.4,84.46 82.04,85.82 82.04,88.87 Y2.1
N$27  (via drill 0.35)
  Top 0.152: IC2.19 79.42,17.07 75.95,20.54 v74.42,20.54 | v70.1,35.78 69.27,35.78 R21.1
  Bottom 0.152: v74.42,20.54 74.42,31.47 v70.1,35.78
N$37
  Top 0.152: IC2.10 83.55,21.83 82.39,22.99 R25.1 79.76,25.29 C23.2 78.32,26.72 Y3.1
N$39
  Top 0.152: IC2.9 84.05,25.26 R25.2 86.46,25.29 | 86.46,25.29 C22.2 | Y3.2 87.88,29.69 87.88,26.64 86.53,25.29 86.46,25.29
N$40  (via drill 0.35)
  Top 0.152: R12.2 54.95,36.63 55.63,37.31 57.91,37.31 58.17,37.05 58.17,36.55 v58.67,36.04 | v85.85,20.04 85.85,19.11 IC2.8
  Bottom 0.152: v58.67,36.04 60.71,34.01 68.07,34.01 71.63,30.45 71.63,26.13 72.64,25.12 72.64,19.53 77.72,19.53 80.77,22.58 80.77,23.34 84.07,23.34 85.85,21.56 v85.85,20.04
N$45
  Top 0.152: J2.17 J2.16
N$47
  Top 0.152: R24.1 89.22,15.07 IC2.2
N$48
  Top 0.152: IC2.1 86.19,13.18 C21.2 R23.1 | R22.1 R23.1 | R23.1
POEVIN+
  Top 0.254: U$1.P$6 23.2,4.54
  Top 0.406: B1.+ 41.03,28.53 42.16,27.4 42.16,21.31 | 42.16,21.31 42.16,16.23 40.89,14.96 29.21,14.96 | B2.+ 42.13,21.34 42.16,21.31 | 23.2,4.54 23.2,12.5 25.65,14.96 29.21,14.96 | U$1.P$6 U$1.P$5 | D7.P$1 29.21,14.96
POEVIN-
  Top 0.254: 23.79,23.08 23.58,22.87 | 23.58,22.87 U$1.P$7 | U$1.P$8 23.2,24.61 | 23.2,23.25 23.58,22.87
  Top 0.406: U$1.P$7 23.2,24.61 23.54,24.95 | U$1.P$8 29.21,25.03 | 29.21,25.03 33.02,25.03 | 33.02,25.03 38.13,25.03 B1.- | B2.- 34.32,18.74 33.02,20.04 33.02,25.03 | D7.P$2 29.21,25.03
RD+
  Top 0.152: J2.1 66.29,25.37 69.09,22.58 77.72,22.58 81.05,19.25 IC2.15
RD-
  Top 0.152: IC2.16 77.81,21.56 67.56,21.56 65.53,23.59 65.42,23.7 65.28,23.85 J2.8
SIM_CLK
  Top 0.152: X2.12 11.45,109.72 11.68,109.95 11.68,110.71 29.46,128.49 40.64,128.49
  Top 0.2: R16.1 46.23,136.79 46.23,130.53 44.2,128.49 40.64,128.49
SIM_DATA
  Top 0.152: X2.10 10.67,106.2 10.67,111.22 28.61,129.17 38.95,129.17
  Top 0.2: R17.2 39.29,132.65 R18.2 38.95,129.17
SIM_RST  (via drill 0.35)
  Top 0.152: X2.14 12.25,109.76 12.7,110.21 v12.7,110.71
  Top 0.2: R15.1 38.95,135.1 36.58,135.1 v36.32,134.84
  Bottom 0.152: v36.32,134.84 12.7,111.22 v12.7,110.71
SIM_VCC
  Top 0.152: X2.8 9.85,125.39 20.7,136.24 34.16,136.24
  Top 0.2: J3.C1 39.01,141.6 38.35,140.94 38.35,137.13 38.27,137.04 C37.1 34.96,137.04 34.16,136.24 33.78,135.86 34.04,135.61 34.04,133.07 36.49,133.07 R18.1
SPI1_CE2  (via drill 0.35)
  Top 0.152: U$3.34 122.25,40.86 112.27,40.86 v112.01,41.12 | X1.51 76.99,93.42 77.22,93.19 77.22,88.87 77.47,88.62 77.72,88.62 78.49,87.85 78.49,63.47 80.26,61.69 80.26,54.83 80.77,54.33 109.73,54.33 110.24,54.83 v111.25,54.83
  Bottom 0.152: v111.25,54.83 111.25,42.13 112.01,41.37 v112.01,41.12
SPI1_MISO  (via drill 0.35)
  Top 0.152: U$3.28 123.43,49.23 122.68,48.48 v78.74,48.48 | X1.47 75.39,94.15 75.18,93.95 75.18,89.12 77.22,87.09 77.47,87.09 77.47,60.93 v77.98,60.42
  Bottom 0.152: v77.98,60.42 77.98,49.25 v78.74,48.48
SPI1_MOSI  (via drill 0.35)
  Top 0.152: U$3.26 122.25,51.02 v82.3,51.02 | X1.49 76.19,94.19 75.95,93.95 75.95,89.12 77.22,87.85 77.72,87.85 77.98,87.6 77.98,62.2 78.74,61.44 v78.74,54.58
  Bottom 0.152: v78.74,54.58 78.74,51.28 78.99,51.02 v82.3,51.02
SPI1_SCLK
  Top 0.152: U$3.24 123.43,54.57 122.43,53.56 77.98,53.56 76.96,54.58 76.96,85.57 74.42,88.11 74.42,94.2 74.59,94.37 X1.45
SPI2_CE0  (via drill 0.35)
  Top 0.152: U$3.19 119.22,59.82 v118.87,60.17 | X3.51 121.18,100.32 121.41,100.55 121.92,100.55 v122.17,100.3
  Bottom 0.152: v118.87,60.17 118.87,86.58 121.16,88.87 121.16,94.2 122.17,95.22 v122.17,100.3
SPI2_MISO  (via drill 0.35)
  Top 0.152: X3.47 119.58,92.12 118.11,90.65 117.09,90.65 116.59,90.14 v116.59,89.89 | v116.59,52.29 116.68,52.2 U$3.25
  Bottom 0.152: v116.59,52.29 v116.59,89.89
SPI2_MOSI  (via drill 0.35)
  Top 0.152: U$3.23 118.36,54.74 118.2,54.74 117.44,54.74 v117.35,54.83 | v118.11,88.87 120.38,91.14 X3.49
  Bottom 0.152: v118.11,88.87 117.35,88.11 v117.35,54.83
SPI2_SCLK  (via drill 0.35)
  Top 0.152: U$3.21 118.45,57.28 118.36,57.37 v118.36,58.64 | X3.45 118.78,94.29 v118.87,94.2
  Bottom 0.152: v118.36,58.64 118.11,58.9 118.11,86.58 118.87,87.35 v118.87,94.2
TD+  (via drill 0.35)
  Top 0.152: IC2.14 81.55,19.76 78.23,23.08 69.6,23.08 v69.09,23.59
  Bottom 0.152: v69.09,23.59 68.58,24.1 64.52,24.1 64.26,24.35 J2.2
TD-  (via drill 0.35)
  Top 0.152: IC2.13 82.05,20.02 78.49,23.59 70.36,23.59 v70.1,23.85
  Bottom 0.152: v70.1,23.85 70.1,22.83 69.34,22.07 64.52,22.07 63.25,23.34 J2.9
USB1+  (via drill 0.35)
  Top 0.152: 91.69,81.76 90.68,82.77 89.66,82.77 v89.41,82.52 | v23.88,102.33 23.88,102.84 25.05,104.01 X2.38
  Top 0.203: U$2.9 93.34,80.62 92.2,81.76 91.69,81.76
  Bottom 0.152: v89.41,82.52 83.06,82.52 65.53,100.05 26.67,100.05 24.38,102.33 v23.88,102.33
USB1-  (via drill 0.35)
  Top 0.152: X2.36 24.25,107.8 23.88,108.17 v23.11,108.17 | 92.96,82.01 92.96,82.27 92.2,83.03 91.69,83.03 v91.44,83.28
  Top 0.203: U$2.8 93.72,81.26 92.96,82.01
  Bottom 0.152: v91.44,83.28 83.06,83.28 65.79,100.55 27.69,100.55 23.88,104.36 23.88,107.41 v23.11,108.17
USB2+  (via drill 0.35)
  Top 0.152: U$2.7 96.92,81.9 97.03,82.01 v97.03,82.52
  Bottom 0.152: v97.03,82.52 97.03,81.5 96.77,81.25 89.66,81.25 89.15,80.74 86.61,80.74 86.36,80.49 80.77,80.49 78.74,78.46 73.23,78.46 J1.3
USB2-  (via drill 0.35)
  Top 0.152: U$2.6 94.21,82.54 93.47,83.28 93.22,83.28 92.96,83.54 v92.96,83.79
  Bottom 0.152: v92.96,83.79 92.96,83.54 91.19,81.76 88.65,81.76 88.39,81.5 86.11,81.5 85.85,81.25 80.01,81.25 78.72,79.96 J1.2
VC12
  Top 0.406: J2.5 58.17,24.1 56.64,22.58 50.55,22.58 48.77,24.35 48.77,25.62 48.46,25.93 B1.~1
VC36
  Top 0.406: J2.10 64.9,17.5 48.77,17.5 47.53,18.74 B2.~1
VC45
  Top 0.406: J2.6 56.13,24.1 55.88,23.85 51.31,23.85 50.29,24.86 50.29,27.4 49.16,28.53 B1.~2
VC78
  Top 0.406: B2.~2 47.47,21.34 49.4,19.4 J2.11

### Text on the board
tNames: V42 | V01-16-2021-1820 | GPS | MPCI-E MODULE | SIM | LORA MODULE 2 | LORA MODULE 1 | GPS | USB | See Documentation / About this header | USB | USB HUB | POWER | RASPBERRY PI CM3 | Smart LoRa / Gateway | https://nebra.io/iot | ETHERNET | 1-2 POE / 2-3 DC | 12V 1.5A / DC | POE
bNames: Smart LoRa Gateway / https://nebra.io/iot | Designed in the United Kingdom